# Altium project AMS_Master.PrjPcb
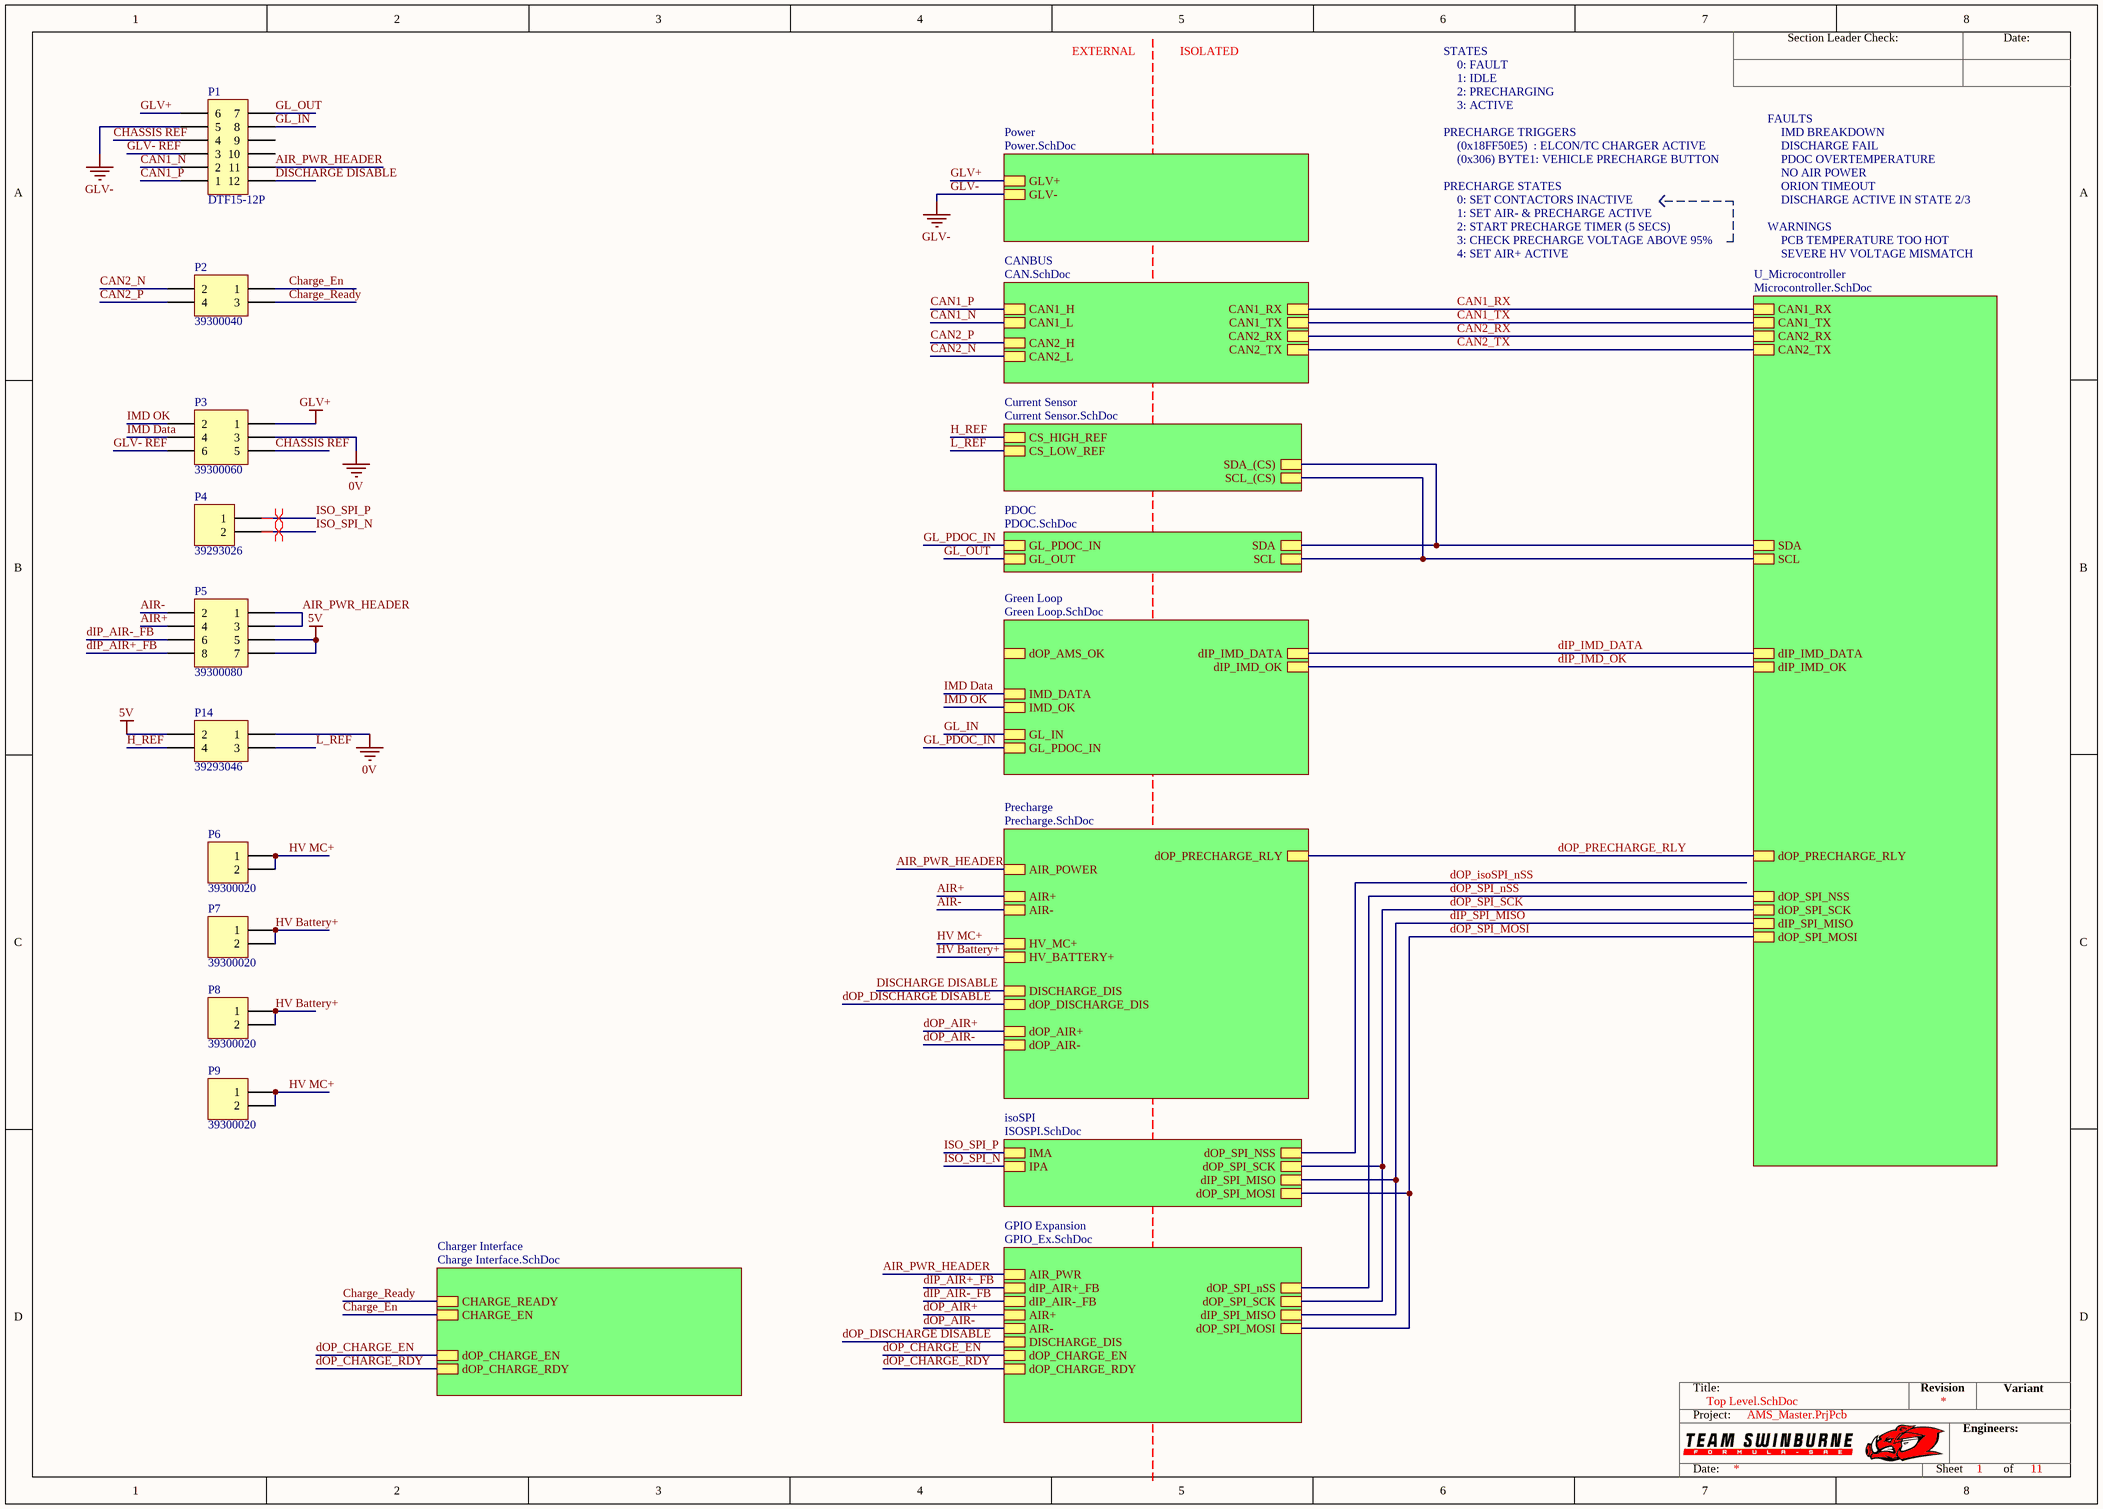
[diagram p0: Top Level.SchDoc]
10 sheets, 185 parts. Net scope: hierarchical (ports join the sheet entries above them; power ports are global).
Board file: AMS_Master_A1.PcbDoc
Sheets:
  Top Level.SchDoc
    U_Microcontroller = Microcontroller.SchDoc
    CANBUS = CAN.SchDoc
    Green Loop = Green Loop.SchDoc
    PDOC = PDOC.SchDoc
    Precharge = Precharge.SchDoc
    Charger Interface = Charge Interface.SchDoc
    Power = Power.SchDoc
    isoSPI = ISOSPI.SchDoc
    GPIO Expansion = GPIO_Ex.SchDoc

## Sheet Top Level.SchDoc
size A3; SheetNumber: 1; SheetTotal: 11

### Parts
P1  DTF15-12P  [DTF15-12P]
P2  39300040  [39300040]
P3  39300060  [39300060]
P4  39293026  [39293026]
P5  39300080  [39300080]
P6  39300020  [39300020]
P7  39300020  [39300020]
P8  39300020  [39300020]
P9  39300020  [39300020]
P14  39293046  [39293046]

### Sub-sheets
CANBUS = CAN.SchDoc: CAN1_RX, CAN1_TX, CAN2_RX, CAN2_TX, CAN1_H, CAN1_L, CAN2_H, CAN2_L
Charger Interface = Charge Interface.SchDoc: CHARGE_READY, CHARGE_EN, dOP_CHARGE_EN, dOP_CHARGE_RDY
Current Sensor = Current Sensor.SchDoc (file not in this document): SCL_(CS), CS_HIGH_REF, CS_LOW_REF, SDA_(CS)
GPIO Expansion = GPIO_Ex.SchDoc: dOP_SPI_nSS, dOP_SPI_SCK, dIP_SPI_MISO, dOP_SPI_MOSI, AIR_PWR, dIP_AIR+_FB, dIP_AIR-_FB, AIR+, AIR-, dOP_CHARGE_RDY, dOP_CHARGE_EN, DISCHARGE_DIS
Green Loop = Green Loop.SchDoc: dIP_IMD_DATA, dIP_IMD_OK, GL_IN, GL_PDOC_IN, IMD_DATA, IMD_OK, dOP_AMS_OK
isoSPI = ISOSPI.SchDoc: dOP_SPI_NSS, dOP_SPI_SCK, dIP_SPI_MISO, dOP_SPI_MOSI, IMA, IPA
PDOC = PDOC.SchDoc: SDA, SCL, GL_PDOC_IN, GL_OUT
Power = Power.SchDoc: GLV+, GLV-
Precharge = Precharge.SchDoc: dOP_AIR-, dOP_AIR+, dOP_PRECHARGE_RLY, DISCHARGE_DIS, AIR+, AIR-, HV_MC+, HV_BATTERY+, dOP_DISCHARGE_DIS, AIR_POWER
U_Microcontroller = Microcontroller.SchDoc: CAN1_RX, CAN1_TX, CAN2_RX, CAN2_TX, dOP_PRECHARGE_RLY, dOP_SPI_NSS, dOP_SPI_SCK, dIP_SPI_MISO, dOP_SPI_MOSI, dIP_IMD_DATA, dIP_IMD_OK, SDA, SCL

### Nets
0V: P3.3 P14.1
DISCHARGE DISABLE: P1.12 P5.5 P5.7 P14.2 ; sheet Precharge/DISCHARGE_DIS  [also labelled 5V]
GLV+: P1.6 P3.1 ; sheet Power/GLV+
GLV-: P1.5 ; sheet Power/GLV-
AIR+: P5.4 ; sheet Precharge/AIR+
AIR-: P5.2 ; sheet Precharge/AIR-
AIR_PWR_HEADER: P1.11 P5.1 P5.3 ; sheet Precharge/AIR_POWER, sheet GPIO Expansion/AIR_PWR
CAN1_N: P1.2 ; sheet CANBUS/CAN1_L
CAN1_P: P1.1 ; sheet CANBUS/CAN1_H
CAN1_RX: sheet U_Microcontroller/CAN1_RX, sheet CANBUS/CAN1_RX
CAN1_TX: sheet U_Microcontroller/CAN1_TX, sheet CANBUS/CAN1_TX
CAN2_N: P2.2 ; sheet CANBUS/CAN2_L
CAN2_P: P2.4 ; sheet CANBUS/CAN2_H
CAN2_RX: sheet U_Microcontroller/CAN2_RX, sheet CANBUS/CAN2_RX
CAN2_TX: sheet U_Microcontroller/CAN2_TX, sheet CANBUS/CAN2_TX
Charge_En: P2.1 ; sheet Charger Interface/CHARGE_EN
Charge_Ready: P2.3 ; sheet Charger Interface/CHARGE_READY
CHASSIS REF: P1.4 P3.5
dIP_AIR+_FB: P5.8 ; sheet GPIO Expansion/dIP_AIR+_FB
dIP_AIR-_FB: P5.6 ; sheet GPIO Expansion/dIP_AIR-_FB
dIP_IMD_DATA: sheet U_Microcontroller/dIP_IMD_DATA, sheet Green Loop/dIP_IMD_DATA
dIP_IMD_OK: sheet U_Microcontroller/dIP_IMD_OK, sheet Green Loop/dIP_IMD_OK
dIP_SPI_MISO: sheet U_Microcontroller/dIP_SPI_MISO, sheet isoSPI/dIP_SPI_MISO, sheet GPIO Expansion/dIP_SPI_MISO
dOP_AIR+: sheet Precharge/dOP_AIR+, sheet GPIO Expansion/AIR+
dOP_AIR-: sheet Precharge/dOP_AIR-, sheet GPIO Expansion/AIR-
dOP_CHARGE_EN: sheet Charger Interface/dOP_CHARGE_EN, sheet GPIO Expansion/dOP_CHARGE_EN
dOP_CHARGE_RDY: sheet Charger Interface/dOP_CHARGE_RDY, sheet GPIO Expansion/dOP_CHARGE_RDY
dOP_DISCHARGE DISABLE: sheet Precharge/dOP_DISCHARGE_DIS, sheet GPIO Expansion/DISCHARGE_DIS
dOP_PRECHARGE_RLY: sheet U_Microcontroller/dOP_PRECHARGE_RLY, sheet Precharge/dOP_PRECHARGE_RLY
dOP_SPI_MOSI: sheet U_Microcontroller/dOP_SPI_MOSI, sheet isoSPI/dOP_SPI_MOSI, sheet GPIO Expansion/dOP_SPI_MOSI
dOP_SPI_nSS: sheet U_Microcontroller/dOP_SPI_NSS, sheet GPIO Expansion/dOP_SPI_nSS
dOP_SPI_SCK: sheet U_Microcontroller/dOP_SPI_SCK, sheet isoSPI/dOP_SPI_SCK, sheet GPIO Expansion/dOP_SPI_SCK
GL_IN: P1.8 ; sheet Green Loop/GL_IN
GL_OUT: P1.7 ; sheet PDOC/GL_OUT
GL_PDOC_IN: sheet Green Loop/GL_PDOC_IN, sheet PDOC/GL_PDOC_IN
GLV- REF: P1.3 P3.6
H_REF: P14.4 ; sheet Current Sensor/CS_HIGH_REF
HV Battery+: P7.1 P7.2 P8.1 P8.2 ; sheet Precharge/HV_BATTERY+
HV MC+: P6.1 P6.2 P9.1 P9.2 ; sheet Precharge/HV_MC+
I2C1_SCL: sheet U_Microcontroller/SCL, sheet PDOC/SCL, sheet Current Sensor/SCL_(CS)
I2C1_SDA: sheet U_Microcontroller/SDA, sheet PDOC/SDA, sheet Current Sensor/SDA_(CS)
IMD Data: P3.4 ; sheet Green Loop/IMD_DATA
IMD OK: P3.2 ; sheet Green Loop/IMD_OK
ISO_SPI_N: P4.2 ; sheet isoSPI/IPA
ISO_SPI_P: P4.1 ; sheet isoSPI/IMA
L_REF: P14.3 ; sheet Current Sensor/CS_LOW_REF

Not connected (* = marked no-connect by the designer): P1 9 10

### Layout directives
differential pair: ISO_SPI_N, ISO_SPI_P

### Notes on the sheet
- EXTERNAL
- ISOLATED
- STATES
- 0: FAULT
- 1: IDLE
- 2: PRECHARGING
- 3: ACTIVE
- PRECHARGE TRIGGERS
- (0x18FF50E5)  : ELCON/TC CHARGER ACTIVE
- (0x306) BYTE1: VEHICLE PRECHARGE BUTTON
- FAULTS
- IMD BREAKDOWN
- DISCHARGE FAIL
- PDOC OVERTEMPERATURE
- NO AIR POWER
- PRECHARGE STATES
- 1: SET AIR- & PRECHARGE ACTIVE
- 2: START PRECHARGE TIMER (5 SECS)
- 3: CHECK PRECHARGE VOLTAGE ABOVE 95%
- 0: SET CONTACTORS INACTIVE
- WARNINGS
- PCB TEMPERATURE TOO HOT
- ORION TIMEOUT
- DISCHARGE ACTIVE IN STATE 2/3
- 4: SET AIR+ ACTIVE
- SEVERE HV VOLTAGE MISMATCH
- Section Leader Check:
- Date:
- Title:
- Revision
- Variant
- Project:
- Engineers:
- Sheet
- of

### Library data of the parts
P1 = DTF15-12P: Positions: 12; Pitch: 4.44mm; Row Spacing: 9.12 mm; Angle: 0; Flange: No; Contact: Copper Alloy; Part Number: DTF15-12P; Digikey Part Number: 1734-1647-ND; Digikey Link: https://www.digikey.com.au/product-detail/en/te-connectivity-deutsch-connectors/DTF15-12PA/1734-1647-ND/7220164
P2 = 39300040: Pitch: 4.2mm; Row Spacing: 5.5mm; Angle: 90; Flange: No; Contact: Tin; Part Number: 39300040; Positions: 4; Digikey Part Number: WM21352-ND
P3 = 39300060: Pitch: 4.2mm; Row Spacing: 5.5mm; Angle: 90; Flange: No; Contact: Tin; Part Number: 39300060; Positions: 6; Digikey Part Number: WM21353-ND
P4 = 39293026: Pitch: 4.2mm; Row Spacing: 5.5mm; Angle: 0; Flange: No; Contact: Tin; Part Number: 39293026; Positions: 2; Digikey Part Number: WM3843-ND
P5 = 39300080: Pitch: 4.2mm; Row Spacing: 5.5mm; Angle: 90; Flange: No; Contact: Tin; Part Number: 39300080; Positions: 8; Digikey Part Number: WM21354-ND
P6-P9 = 39300020: Pitch: 4.2mm; Row Spacing: 5.5mm; Angle: 90; Flange: No; Contact: Tin; Part Number: 39300020; Positions: 2; Digikey Part Number: WM21351-ND
P14 = 39293046: Pitch: 4.2mm; Row Spacing: 5.5mm; Angle: 0; Flange: No; Contact: Tin; Part Number: 39293046; Positions: 4; Digikey Part Number: WM3844-ND

## Sheet Microcontroller.SchDoc
size A4; SheetNumber: 7; SheetTotal: 11
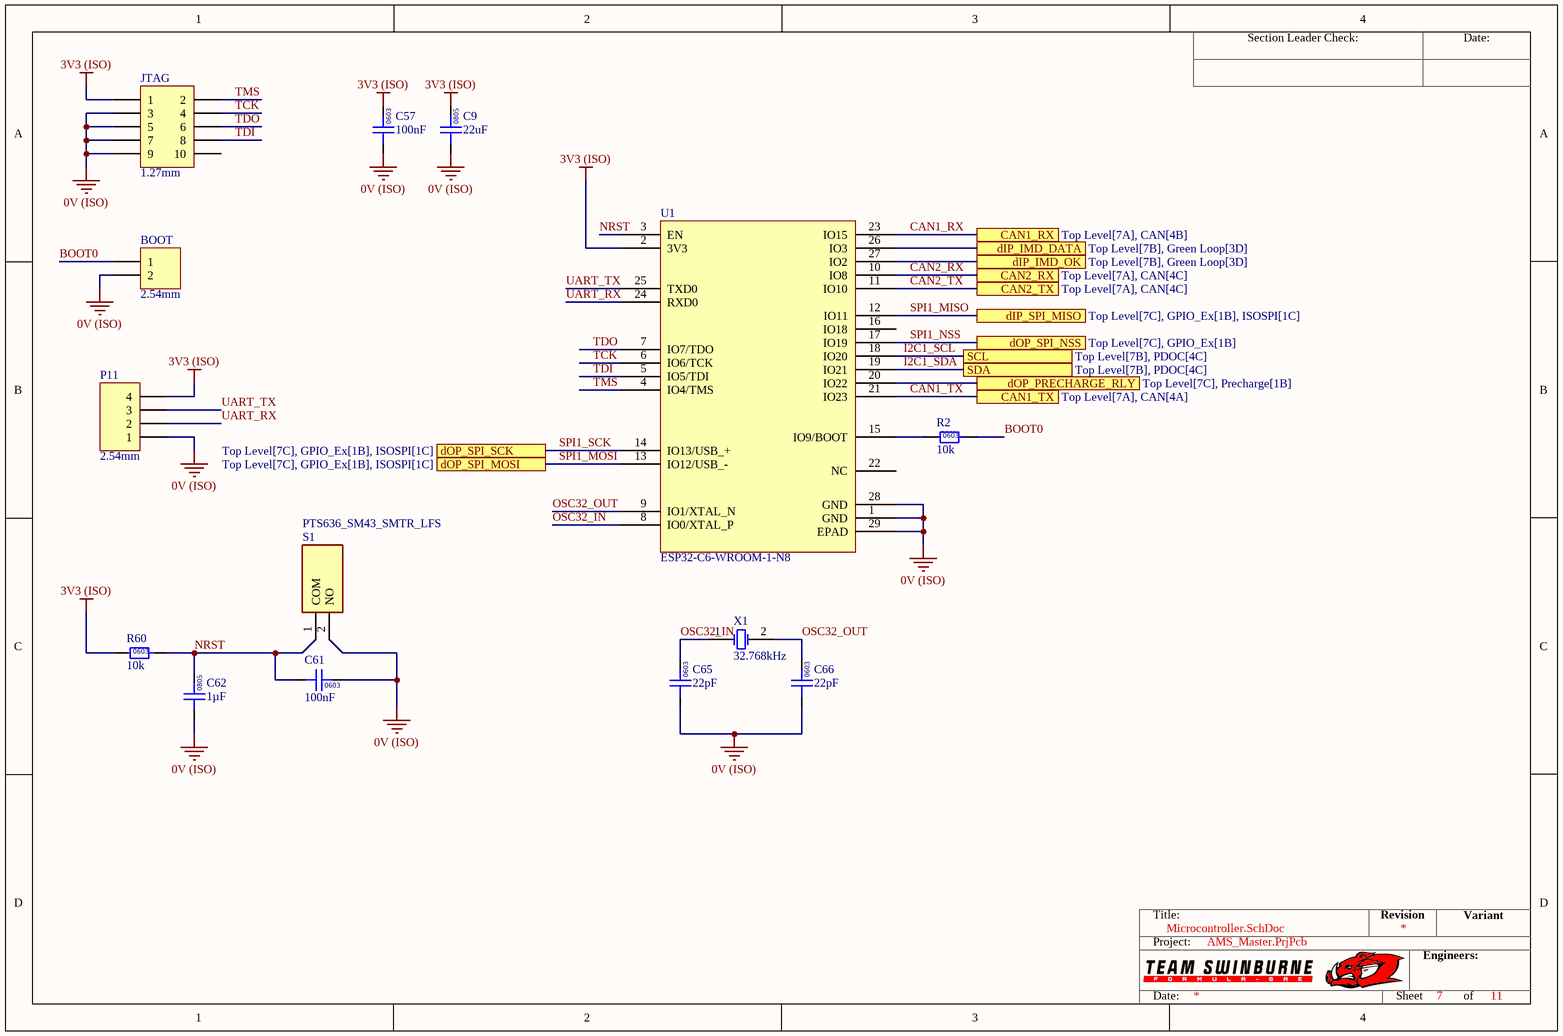
[diagram p1: Microcontroller.SchDoc]

### Parts
BOOT  2.54mm  [TH 2.54mm Header 1x2]
C9  22uF  [0805]
C57  100nF  [0603]
C61  100nF  [0603]
C62  1µF  [0805]
C65  22pF  [0603]
C66  22pF  [0603]
JTAG  1.27mm  [3221-10-0300-00]
P11  2.54mm  [TH 2.54mm Header 1x4]
R2  10k  [0603]
R60  10k  [0603]
S1  PTS636_SM43_SMTR_LFS  [PTS636SM43SMTRLFS]
U1  ESP32-C6-WROOM-1-N8  [ESP32-C6-WROOM-1-N8]
X1  32.768kHz  [EPSON 2-SMD]

### Ports
CAN1_RX (see Top Level[7A], CAN[4B]), CAN1_TX (see Top Level[7A], CAN[4A]), CAN2_RX (see Top Level[7A], CAN[4C]), CAN2_TX (see Top Level[7A], CAN[4C]), dIP_IMD_DATA (see Top Level[7B], Green Loop[3D]), dIP_IMD_OK (see Top Level[7B], Green Loop[3D]), dIP_SPI_MISO (see Top Level[7C], GPIO_Ex[1B], ISOSPI[1C]), dOP_PRECHARGE_RLY (see Top Level[7C], Precharge[1B]), dOP_SPI_MOSI (see Top Level[7C], GPIO_Ex[1B], ISOSPI[1C]), dOP_SPI_NSS (see Top Level[7C], GPIO_Ex[1B]), dOP_SPI_SCK (see Top Level[7C], GPIO_Ex[1B], ISOSPI[1C]), SCL (see Top Level[7B], PDOC[4C]), SDA (see Top Level[7B], PDOC[4C])

### Nets
0V (ISO): BOOT.2 C9.1 C57.1 C61.2 C62.1 C65.1 C66.1 JTAG.3 JTAG.5 JTAG.7 JTAG.9 P11.1 S1.2(NO) U1.1(GND) U1.28(GND) U1.29(EPAD)
3V3 (ISO): C9.2 C57.2 JTAG.1 P11.4 R60.1 U1.2(3V3)
BOOT0: BOOT.1 R2.2
CAN1_RX: U1.23(IO15) ; port CAN1_RX
CAN1_TX: U1.21(IO23) ; port CAN1_TX
CAN2_RX: U1.10(IO8) ; port CAN2_RX
CAN2_TX: U1.11(IO10) ; port CAN2_TX
dIP_IMD_DATA: U1.26(IO3) ; port dIP_IMD_DATA
dIP_IMD_OK: U1.27(IO2) ; port dIP_IMD_OK
dOP_PRECHARGE_RLY: U1.20(IO22) ; port dOP_PRECHARGE_RLY
I2C1_SCL: U1.18(IO20) ; port SCL
I2C1_SDA: U1.19(IO21) ; port SDA
NRST: C61.1 C62.2 R60.2 S1.1(COM) U1.3(EN)
OSC32_IN: C65.2 U1.8(IO0/XTAL_P) X1.1(OSC1)
OSC32_OUT: C66.2 U1.9(IO1/XTAL_N) X1.2(OSC2)
SPI1_MISO: U1.12(IO11) ; port dIP_SPI_MISO  [project net dIP_SPI_MISO]
SPI1_MOSI: U1.13(IO12/USB_-) ; port dOP_SPI_MOSI  [project net dOP_SPI_MOSI]
SPI1_NSS: U1.17(IO19) ; port dOP_SPI_NSS  [project net dOP_SPI_nSS]
SPI1_SCK: U1.14(IO13/USB_+) ; port dOP_SPI_SCK  [project net dOP_SPI_SCK]
TCK: JTAG.4 U1.6(IO6/TCK)
TDI: JTAG.8 U1.5(IO5/TDI)
TDO: JTAG.6 U1.7(IO7/TDO)
TMS: JTAG.2 U1.4(IO4/TMS)
UART_RX: P11.2 U1.24(RXD0)
UART_TX: P11.3 U1.25(TXD0)
NetR2_1: R2.1 U1.15(IO9/BOOT)

Not connected (* = marked no-connect by the designer): JTAG 10; U1 16(IO18) 22(NC)

### Notes on the sheet
- Section Leader Check:
- Date:
- Title:
- Revision
- Variant
- Project:
- Engineers:
- Sheet
- of
- (in symbol GCM21BR71H105KA03L) 0805
- (in symbol GCM188L81H104KA57D) 0603
- (in symbol GRM21BR61A226ME51L) 0805
- (in symbol GRM0335C1H220JA01D) 0603
- (in symbol RC0603FR-0710KL) 0603

### Library data of the parts
BOOT = TH 2.54mm Header 1x2: Positions: 2; Angle: 0; Flange: No; Contact: NA; Part Number: TH 2.54mm Header 1x2; Pitch: 2.54mm; Row Spacing: 2.54mm
C9 = GRM21BR61A226ME51L: Manufacturer: muRata; Rated Voltage: 50V; Tolerance: 20%; Material: MLCC; Temperature Rating: X5R; Part Number: GRM21BR61A226ME51L; Value: 22uF; Digikey Part Number: 490-10511-1-ND
C57 C61 = GCM188L81H104KA57D: Manufacturer: muRata; Rated Voltage: 50V; Tolerance: ±10%; Material: MLCC; Temperature Rating: X8L; Part Number: GCM188L81H104KA57D; Value: 100nF; Digikey Part Number: 490-6049-1-ND
C62 = GCM21BR71H105KA03L: Manufacturer: muRata; Rated Voltage: 50V; Tolerance: ±10%; Material: MLCC; Temperature Rating: X7R; Part Number: GCM21BR71H105KA03L; Value: 1µF; Digikey Part Number: 490-10675-1-ND
C65 C66 = GRM0335C1H220JA01D: Manufacturer: Murata Electronics; Rated Voltage: 50V; Tolerance: ±5%; Material: MLCC; Temperature Rating: C0G, NP0; Part Number: GRM0335C1H220JA01D; Value: 22pF; Digikey Part Number: 490-6123-1-ND
JTAG = SMD 1.27mm Header 2x5 (3221-10-0300-00): Positions: 10; Angle: 0; Flange: No; Contact: NA; Part Number: SMD 1.27mm Header 2x5 (3221-10-0300-00); Pitch: 1.27mm; Row Spacing: 1.27mm
P11 = TH 2.54mm Header 1x4: Positions: 4; Angle: 0; Flange: No; Contact: NA; Part Number: TH 2.54mm Header 1x4; Pitch: 2.54mm; Row Spacing: 2.54mm
R2 R60 = RC0603FR-0710KL: Manufacturer: YAGEO; Tolerance: 0.01; Rated Power: 0.1W; Part Number: RC0603FR-0710KL; Value: 10k; Material: FR-07; Digikey Part Number: 311-10.0KHRCT-ND
S1 = PTS636_SM43_SMTR_LFS: Switch; Manufacturer_Name: C & K COMPONENTS; Manufacturer_Part_Number: PTS636 SM43 SMTR LFS; Datasheet Link: https://componentsearchengine.com/Datasheets/1/PTS636 SM43 SMTR LFS.pdf; Height: 4.5mm; Mouser Part Number: 611-PTS636SM43SMTRLF; Mouser Price/Stock: https://www.mouser.co.uk/ProductDetail/CK/PTS636-SM43-SMTR-LFS?qs=vLWxofP3U2xu5raMGkTmHg%3D%3D; Arrow Part Number: PTS636 SM43 SMTR LFS; Arrow Price/Stock: https://www.arrow.com/en/products/pts636-sm43-smtr-lfs/ck
U1 = ESP32-C6-WROOM-1-N8: RF TXRX MOD BT WIFI PCB TH SMD; Manufacturer: Espressif; Complex IC: 1; Part Number: ESP32-C6-WROOM-1-N8
X1 = FC-135 32.7680KA-A5: Manufacturer: EPSON; Load Capacitance: 12.5pF; ESR: 70k; Part Number: FC-135 32.7680KA-A5; Value: 32.768kHz; Digikey Part Number: SER4103TR-ND; Digikey Link: https://www.digikey.com/product-detail/en/epson/FC-135-32.7680KA-A5/SER4103TR-ND/5259895

## Sheet CAN.SchDoc
size A4; SheetNumber: 2; SheetTotal: 11
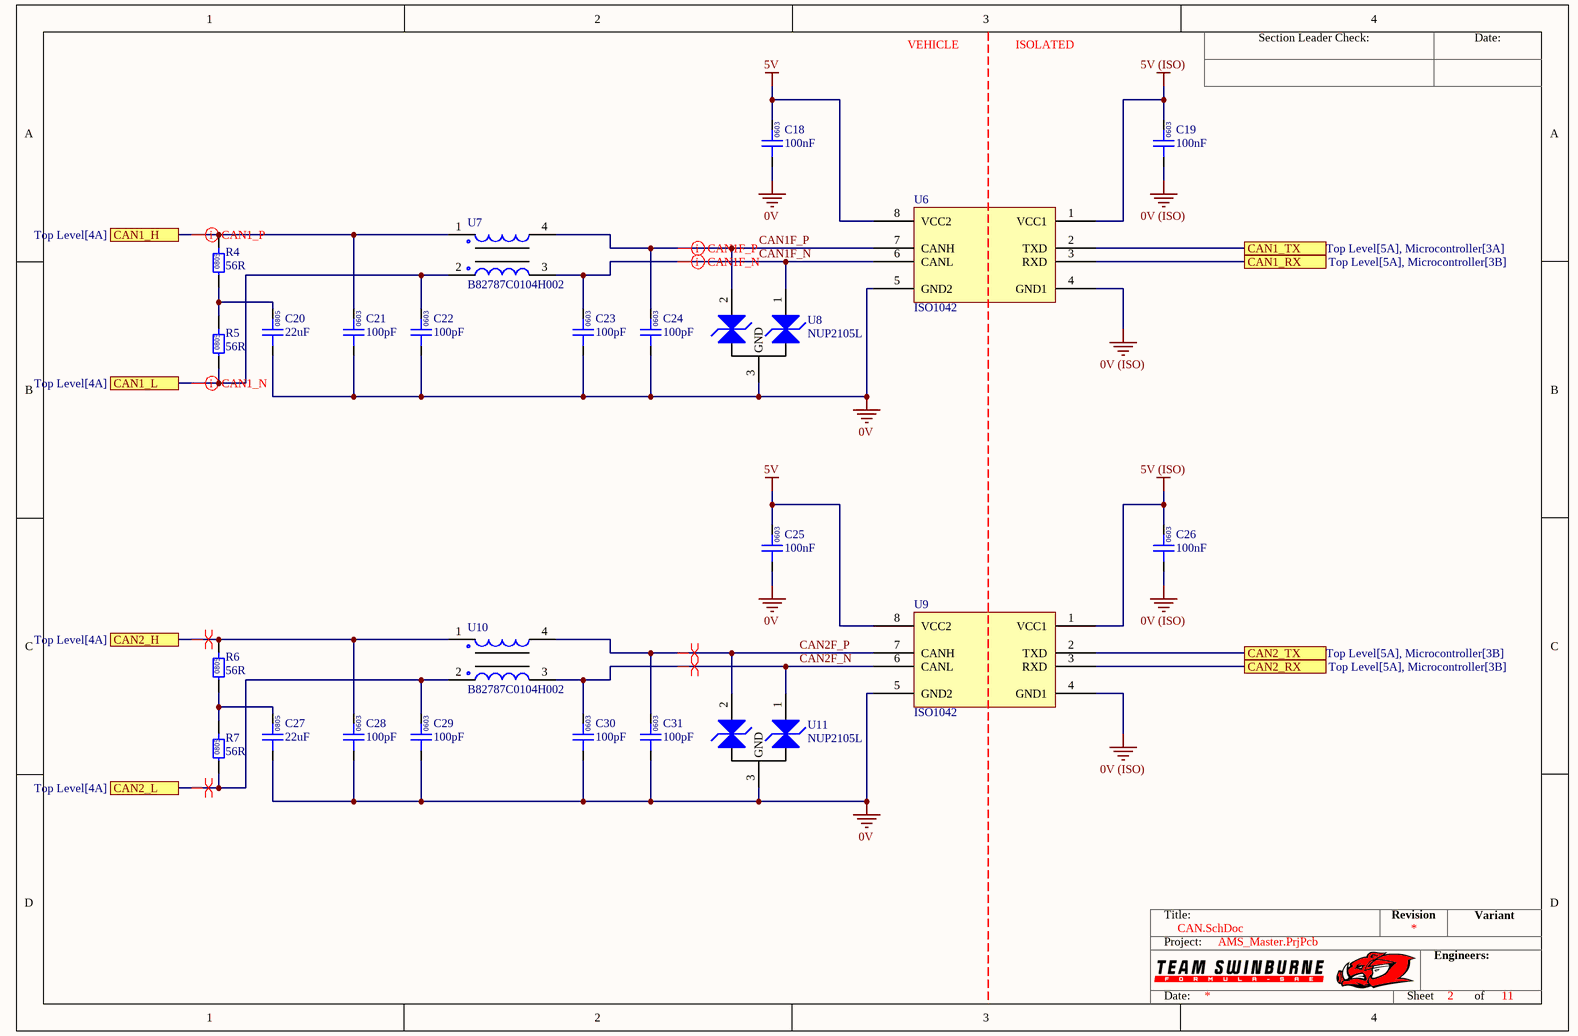
[diagram p2: CAN.SchDoc]

### Parts
C18  100nF  [0603]
C19  100nF  [0603]
C20  22uF  [0805]
C21  100pF  [0603]
C22  100pF  [0603]
C23  100pF  [0603]
C24  100pF  [0603]
C25  100nF  [0603]
C26  100nF  [0603]
C27  22uF  [0805]
C28  100pF  [0603]
C29  100pF  [0603]
C30  100pF  [0603]
C31  100pF  [0603]
R4  56R  [0805]
R5  56R  [0805]
R6  56R  [0805]
R7  56R  [0805]
U6  ISO1042  [TI-SOIC-8]
U7  B82787C0104H002  [TDK 4-PC Pad]
U8  NUP2105L  [ON SOT-23]
U9  ISO1042  [TI-SOIC-8]
U10  B82787C0104H002  [TDK 4-PC Pad]
U11  NUP2105L  [ON SOT-23]

### Ports
CAN1_H (see Top Level[4A]), CAN1_L (see Top Level[4A]), CAN1_RX (see Top Level[5A], Microcontroller[3B]), CAN1_TX (see Top Level[5A], Microcontroller[3A]), CAN2_H (see Top Level[4A]), CAN2_L (see Top Level[4A]), CAN2_RX (see Top Level[5A], Microcontroller[3B]), CAN2_TX (see Top Level[5A], Microcontroller[3B])

### Nets
0V: C18.1 C20.1 C21.1 C22.1 C23.1 C24.1 C25.1 C27.1 C28.1 C29.1 C30.1 C31.1 U6.5(GND2) U8.3(GND) U9.5(GND2) U11.3(GND)
0V (ISO): C19.1 C26.1 U6.4(GND1) U9.4(GND1)
5V: C18.2 C25.2 U6.8(VCC2) U9.8(VCC2)  [project net DISCHARGE DISABLE]
5V (ISO): C19.2 C26.2 U6.1(VCC1) U9.1(VCC1)
CAN1_N: C22.2 R5.1 U7.2 ; port CAN1_L
CAN1_P: C21.2 R4.2 U7.1 ; port CAN1_H
CAN1_RX: U6.3(RXD) ; port CAN1_RX
CAN1_TX: U6.2(TXD) ; port CAN1_TX
CAN1F_N: C23.2 U6.6(CANL) U7.3 U8.1(CAN_H)
CAN1F_P: C24.2 U6.7(CANH) U7.4 U8.2(CAN_L)
CAN2_N: C29.2 R7.1 U10.2 ; port CAN2_L
CAN2_P: C28.2 R6.2 U10.1 ; port CAN2_H
CAN2_RX: U9.3(RXD) ; port CAN2_RX
CAN2_TX: U9.2(TXD) ; port CAN2_TX
CAN2F_N: C30.2 U9.6(CANL) U10.3 U11.1(CAN_H)
CAN2F_P: C31.2 U9.7(CANH) U10.4 U11.2(CAN_L)
NetC20_2: C20.2 R4.1 R5.2
NetC27_2: C27.2 R6.1 R7.2

### Layout directives
differential pair: CAN1_N, CAN1_P, CAN1F_N, CAN1F_P, CAN2_N, CAN2_P, CAN2F_N, CAN2F_P

### Notes on the sheet
- VEHICLE
- ISOLATED
- Section Leader Check:
- Date:
- Title:
- Revision
- Variant
- Project:
- Engineers:
- Sheet
- of
- (in symbol GCM188L81H104KA57D) 0603
- (in symbol GRM21BR61A226ME51L) 0805
- (in symbol GRM1885C1H101JA01D) 0603
- (in symbol RC0805FR0756RL) 0805

### Library data of the parts
C18 C19 C25 C26 = GCM188L81H104KA57D: as C57 on sheet Microcontroller; Part Number: GCM188L81H104KA57D; Value: 100nF; Digikey Part Number: 490-6049-1-ND
C20 C27 = GRM21BR61A226ME51L: Manufacturer: muRata; Rated Voltage: 10V; Tolerance: 20%; Material: MLCC; Temperature Rating: X5R; Part Number: GRM21BR61A226ME51L; Value: 22uF; Digikey Part Number: 490-10511-1-ND
C21-C24 C28-C31 = GRM1885C1H101JA01D: Manufacturer: Murata Electronics; Rated Voltage: 50V; Tolerance: ±5%; Material: MLCC; Temperature Rating: C0G, NP0; Part Number: GRM1885C1H101JA01D; Value: 100pF; Digikey Part Number: 490-1427-1-ND
R4-R7 = RC0805FR0756RL: Manufacturer: YAGEO; Tolerance: 0.01; Rated Power: 0.125W; Part Number: RC0805FR0756RL; Value: 56R; Material: FR-07; Digikey Part Number: 311-56.0CRCT-ND
U6 U9 = ISO1042: IC CAN TRANSCEIVER 1/1 8SOIC; Manufacturer: Texas Instruments; Part Number: ISO1042; Digikey Part Number: 296-ISO1042BQDWVQ1-ND
U7 U10 = B82787C0104H002: Manufacturer: EPCOS (TDK); Value: 100µH @ 100kHz; Impedance: 5.8 kOhms @ 10MHz; Rated Current: 150mA; Part Number: B82787C0104H002; Material: Wirewound; Digikey Part Number: 495-4598-1-ND
U8 U11 = NUP2105L: Dual Line CAN Bus Protector; Manufacturer: ON Semiconductor; Part Number: NUP2105L; Digikey Part Number: NUP2105LT1GOSCT-ND; Digikey Link: https://www.digikey.com/product-detail/en/on-semiconductor/NUP2105LT1G/NUP2105LT1GOSCT-ND/1485001

## Sheet Green Loop.SchDoc
size A3; SheetNumber: 5; SheetTotal: 11
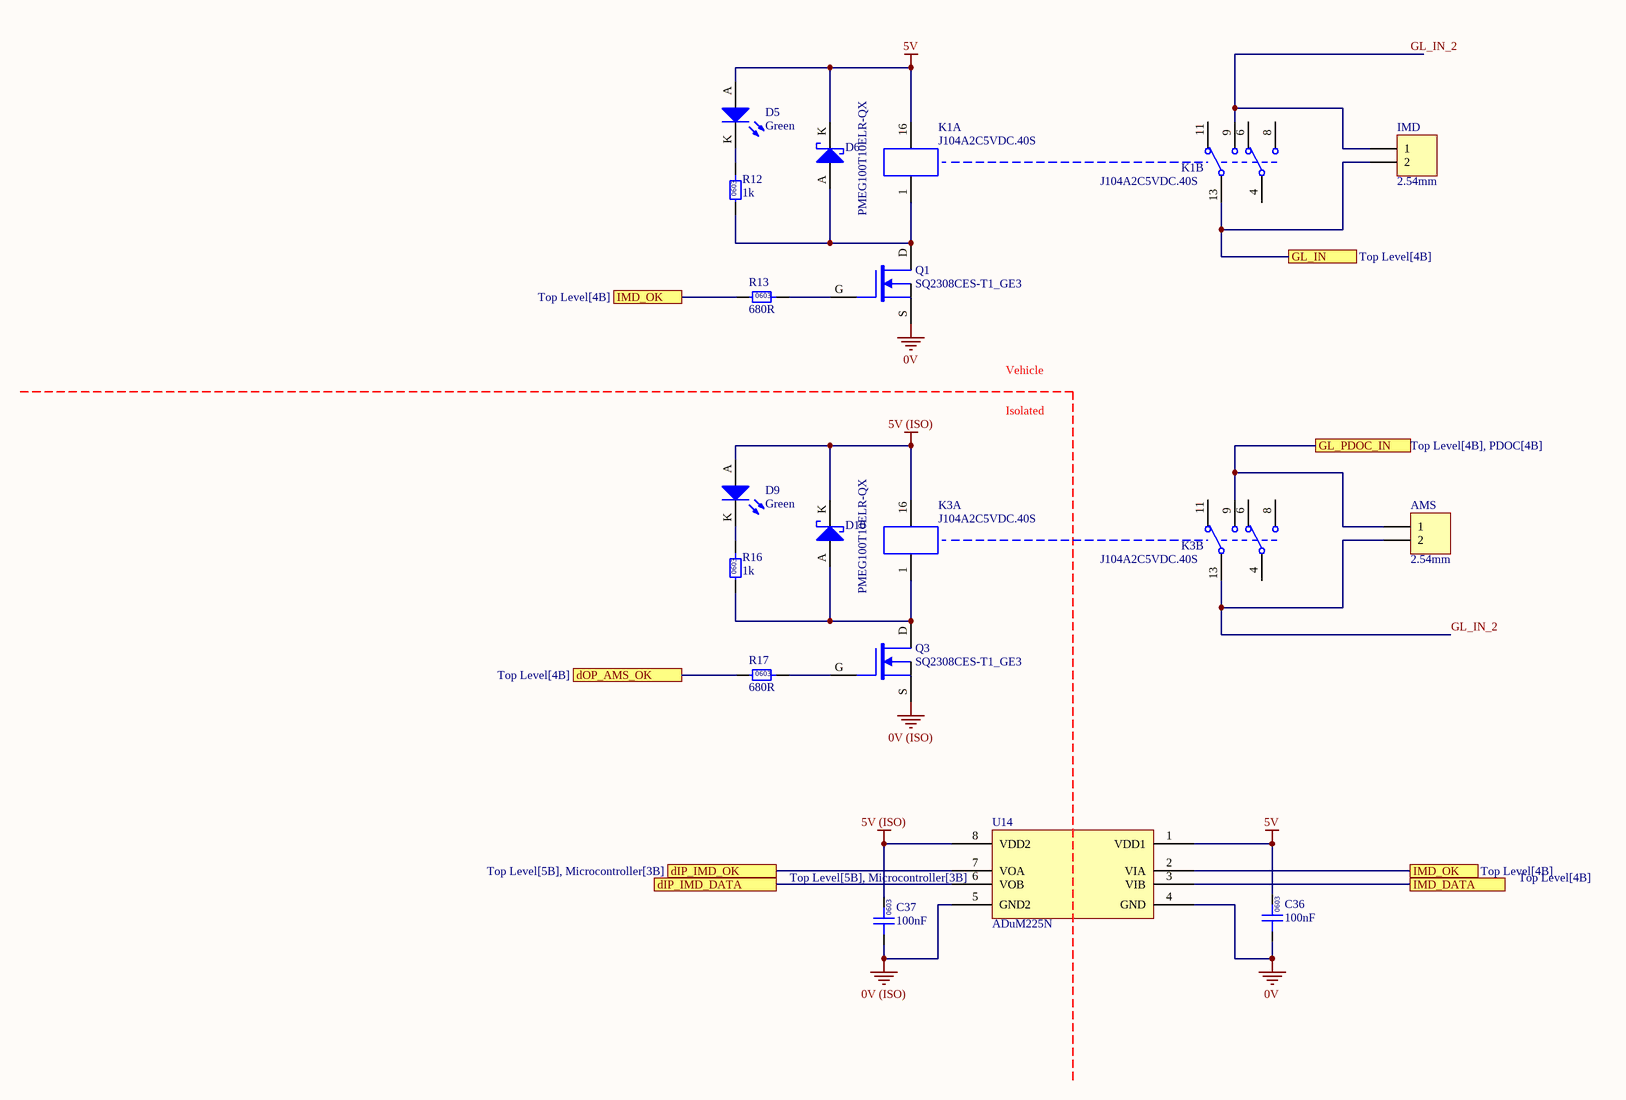
[diagram p3: Green Loop.SchDoc]

### Parts
AMS  2.54mm  [TH 2.54mm Header 1x2]
C36  100nF  [0603]
C37  100nF  [0603]
D5  Green  [0805 LED]
D6  PMEG100T10ELR-QX  [NXP SOD123W]
D9  Green  [0805 LED]
D10  PMEG100T10ELR-QX  [NXP SOD123W]
IMD  2.54mm  [TH 2.54mm Header 1x2]
K1  J104A2C5VDC.40S  [TI 2-DIL]  (parts A,B of 2)
K3  J104A2C5VDC.40S  [TI 2-DIL]  (parts A,B of 2)
Q1  SQ2308CES-T1_GE3  [VSHY SOT-23-3]
Q3  SQ2308CES-T1_GE3  [VSHY SOT-23-3]
R12  1k  [0603]
R13  680R  [0603]
R16  1k  [0603]
R17  680R  [0603]
U14  ADuM225N  [AD-SOIC-8W]

### Ports
dIP_IMD_DATA (see Top Level[5B], Microcontroller[3B]), dIP_IMD_OK (see Top Level[5B], Microcontroller[3B]), dOP_AMS_OK (see Top Level[4B]), GL_IN (see Top Level[4B]), GL_PDOC_IN (see Top Level[4B], PDOC[4B]), IMD_DATA (see Top Level[4B]), IMD_OK (see Top Level[4B])

### Nets
0V: C36.1 Q1.S U14.4(GND)
0V (ISO): C37.1 Q3.S U14.5(GND2)
5V: C36.2 D5.A D6.K K1.16 U14.1(VDD1)  [project net DISCHARGE DISABLE]
5V (ISO): C37.2 D9.A D10.K K3.16 U14.8(VDD2)
dIP_IMD_DATA: U14.6(VOB) ; port dIP_IMD_DATA
dIP_IMD_OK: U14.7(VOA) ; port dIP_IMD_OK
GL_IN: IMD.2 K1.13 ; port GL_IN
GL_IN_2: AMS.2 IMD.1 K1.9 K3.13
GL_PDOC_IN: AMS.1 K3.9 ; port GL_PDOC_IN
IMD Data: U14.3(VIB) ; port IMD_DATA
IMD OK: R13.1 U14.2(VIA) ; port IMD_OK
NetD5_K: D5.K R12.2
NetD6_A: D6.A K1.1 Q1.D R12.1
NetD9_K: D9.K R16.2
NetD10_A: D10.A K3.1 Q3.D R16.1
NetQ1_G: Q1.G R13.2
NetQ3_G: Q3.G R17.2
NetR17_1: R17.1 ; port dOP_AMS_OK

Not connected (* = marked no-connect by the designer): K1 4 6 8 11; K3 4 6 8 11

### Notes on the sheet
- Vehicle
- Isolated
- Section Leader Check:
- Date:
- Title:
- Revision
- Variant
- Project:
- Engineers:
- Sheet
- of
- (in symbol GCM188L81H104KA57D) 0603
- (in symbol RC0603FR-071KL) 0603
- (in symbol RC0603JR-13680RL) 0603

### Library data of the parts
AMS IMD = TH 2.54mm Header 1x2: as BOOT on sheet Microcontroller; Part Number: TH 2.54mm Header 1x2; Pitch: 2.54mm; Row Spacing: 2.54mm
C36 C37 = GCM188L81H104KA57D: as C57 on sheet Microcontroller; Part Number: GCM188L81H104KA57D; Value: 100nF; Digikey Part Number: 490-6049-1-ND
D5 D9 = SML-210FTT86: Green LED Indication - Discrete 1.75V 0805 (2012 Metric); Manufacturer: ROHM Semiconductor; Part Number: SML-210FTT86; Colour: Green; Digikey Part Number: 511-1285-1-ND; Digikey Link: https://www.digikey.com/product-detail/en/rohm-semiconductor/SML-210FTT86/511-1285-1-ND/637098
D6 D10 = PMEG100T10ELR-QX: Manufacturer: Nexperia USA Inc.; Forward Voltage: 0.75 V @ 1A; Breakdown Voltage: 100 V; Rated Power: 680 mW; Part Number: PMEG100T10ELR-QX; Digikey Part Number: 1727-PMEG100T10ELR-QXCT-ND
K1 K3 = J104A2C5VDC.40S: RELAY GEN PURPOSE DPDT 3A 5V; Manufacturer: CIT Relay and Switch; Part Number: J104A2C5VDC.40S; Digikey Part Number: 2449-J104A2C5VDC.40S-ND; Digikey Link: https://www.digikey.com.au/en/products/detail/cit-relay-and-switch/J104A2C5VDC-40S/14002119
Q1 Q3 = SQ2308CES-T1_GE3: MOSFET N-CH 60V 2.3A SOT23; Manufacturer: Vishay Siliconix; Type: N-channel; Rated Power: 2W; Published: 24-Mar-1999; LatestRevisionDate: 29-May-2009; LatestRevisionNote: IPC-7351 Footprint Added.; PackageVersion: Sep-2000; PackageReference: SOT-343; Publisher: Altium Limited; PackageDescription: 4-Pin SOT-343 Package 1.3 mm Pitch, 2.1 mm Lead Span; Part Number: SQ2308CES-T1_GE3; Digikey Part Number: SQ2308CES-T1_GE3CT-ND
R12 R16 = RC0603FR-071KL: Manufacturer: YAGEO; Tolerance: 0.01; Rated Power: 0.1W; Part Number: RC0603FR-071KL; Value: 1k; Material: FR-07; Digikey Part Number: 311-1.00KHRCT-ND
R13 R17 = RC0603JR-13680RL: Manufacturer: YAGEO; Tolerance: 0.01; Rated Power: 0.1W; Part Number: RC0603JR-13680RL; Value: 680R; Material: FR-07; Digikey Part Number: 13-RC0603JR-13680RLCT-ND
U14 = ADuM225N: DIGITAL ISOLATOR, DUAL CHANNEL; Manufacturer: Analogue Devices; Part Number: ADuM225N

## Sheet PDOC.SchDoc
size A4; SheetNumber: 8; SheetTotal: 11
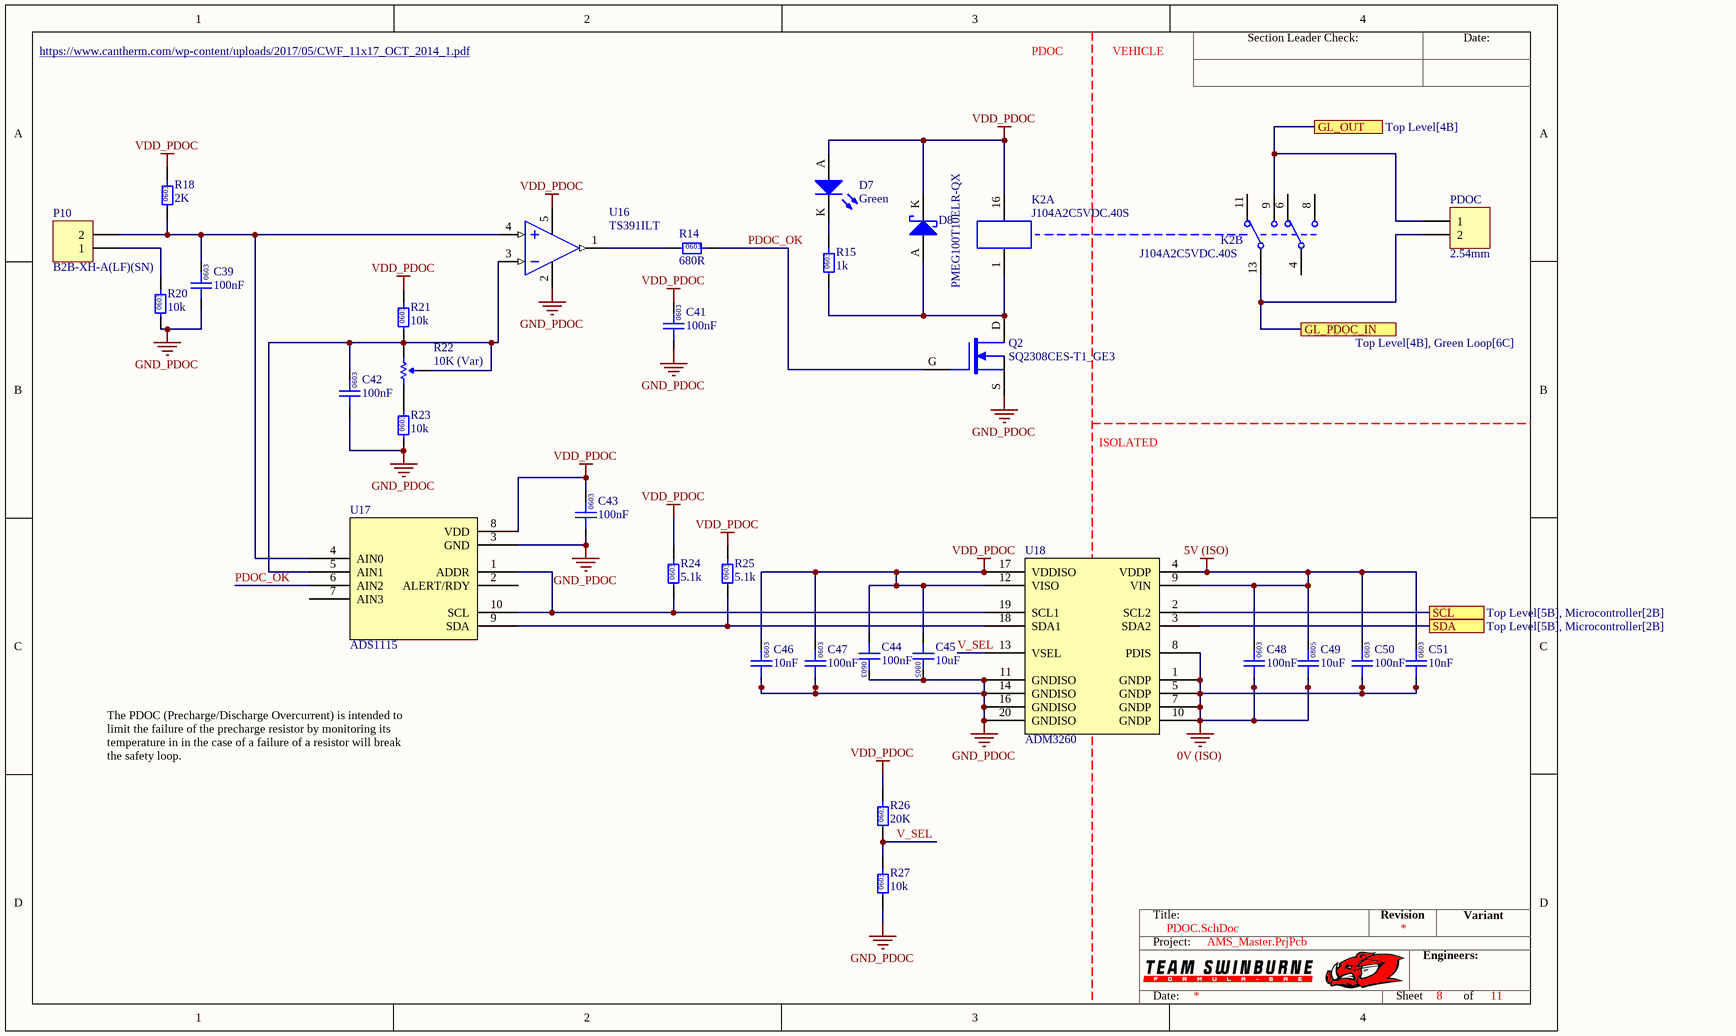
[diagram p4: PDOC.SchDoc]

### Parts
C39  100nF  [0603]
C41  100nF  [0603]
C42  100nF  [0603]
C43  100nF  [0603]
C44  100nF  [0603]
C45  10uF  [0805]
C46  10nF  [0603]
C47  100nF  [0603]
C48  100nF  [0603]
C49  10uF  [0805]
C50  100nF  [0603]
C51  10nF  [0603]
D7  Green  [0805 LED]
D8  PMEG100T10ELR-QX  [NXP SOD123W]
K2  J104A2C5VDC.40S  [TI 2-DIL]  (parts A,B of 2)
P10  B2B-XH-A(LF)(SN)  [XH 2 PIN VERT]
PDOC  2.54mm  [TH 2.54mm Header 1x2]
Q2  SQ2308CES-T1_GE3  [VSHY SOT-23-3]
R14  680R  [0603]
R15  1k  [0603]
R18  2K  [0603]
R20  10k  [0603]
R21  10k  [0603]
R22  10K (Var)  [B 3296]
R23  10k  [0603]
R24  5.1k  [0603]
R25  5.1k  [0603]
R26  20K  [0603]
R27  10k  [0603]
U16  TS391ILT  [ON SOT-23-5]
U17  ADS1115  [TI 10-VSSOP]
U18  ADM3260  [AD 20-SSOP]

### Ports
GL_OUT (see Top Level[4B]), GL_PDOC_IN (see Top Level[4B], Green Loop[6C]), SCL (see Top Level[5B], Microcontroller[2B]), SDA (see Top Level[5B], Microcontroller[2B])

### Nets
0V (ISO): C48.1 C49.1 C50.1 C51.1 U18.1(GNDP) U18.5(GNDP) U18.7(GNDP) U18.8(PDIS) U18.10(GNDP)
5V (ISO): C48.2 C49.2 C50.2 C51.2 U18.4(VDDP) U18.9(VIN)
GND_PDOC: C39.1 C41.1 C42.1 C43.1 C44.2 C45.2 C46.1 C47.1 Q2.S R20.1 R23.1 R27.1 U16.2(VCC-) U17.3(GND) U18.11(GNDISO) U18.14(GNDISO) U18.16(GNDISO) U18.20(GNDISO)
VDD_PDOC: C41.2 C43.2 C44.1 C45.1 C46.2 C47.2 D7.A D8.K K2.16 R18.2 R21.2 R24.2 R25.2 R26.2 U16.5(VCC+) U17.8(VDD) U18.12(VISO) U18.17(VDDISO)
GL_OUT: K2.9 PDOC.1 ; port GL_OUT
GL_PDOC_IN: K2.13 PDOC.2 ; port GL_PDOC_IN
I2C1_SCL: U18.2(SCL2) ; port SCL
I2C1_SDA: U18.3(SDA2) ; port SDA
PDOC_OK: Q2.G R14.2 U17.6(AIN2)
V_SEL: R26.1 R27.2 U18.13(VSEL)
NetC39_2: C39.2 P10.2 R18.1 U16.4(IIN+) U17.4(AIN0)
NetC42_2: C42.2 R21.1 R22.1(CCW) R22.2(Wiper) U16.3(IN-) U17.5(AIN1)
NetD7_K: D7.K R15.2
NetD8_A: D8.A K2.1 Q2.D R15.1
NetP10_1: P10.1 R20.2
NetR14_1: R14.1 U16.1(OUT)
NetR22_3: R22.3(CW) R23.2
NetR24_1: R24.1 U17.1(ADDR) U17.10(SCL) U18.19(SCL1)
NetR25_1: R25.1 U17.9(SDA) U18.18(SDA1)

Not connected (* = marked no-connect by the designer): K2 4 6 8 11; U17 2(ALERT/RDY) 7(AIN3)

### Notes on the sheet
- https://www.cantherm.com/wp-content/uploads/2017/05/CWF_11x17_OCT_2014_1.pdf
- PDOC
- VEHICLE
- ISOLATED
- The PDOC (Precharge/Discharge Overcurrent) is intended to limit the failure of the precharge resistor by monitoring its temperature in in the case of a failure of a resistor will break the safety loop.
- Section Leader Check:
- Date:
- Title:
- Revision
- Variant
- Project:
- Engineers:
- Sheet
- of
- (in symbol GCM188L81H103KA03D) 0603
- (in symbol GCM188L81H104KA57D) 0603
- (in symbol GRM21BR6YA106KE43L) 0805
- (in symbol RC0603FR-071KL) 0603
- (in symbol RC0603FR-072KL) 0603
- (in symbol RC0603FR-0710KL) 0603
- (in symbol RC0603FR-0720KL) 0603
- (in symbol RC0603JR-075K1L) 0603
- (in symbol RC0603JR-13680RL) 0603

### Library data of the parts
C39 C41-C44 C47 C48 C50 = GCM188L81H104KA57D: as C57 on sheet Microcontroller; Part Number: GCM188L81H104KA57D; Value: 100nF; Digikey Part Number: 490-6049-1-ND
C45 C49 = GRM21BR6YA106KE43L: Manufacturer: muRata; Rated Voltage: 50V; Tolerance: 10%; Material: MLCC; Temperature Rating: X5R; Part Number: GRM21BR6YA106KE43L; Value: 10uF; Digikey Part Number: 490-10514-6-ND
C46 C51 = GCM188L81H103KA03D: Manufacturer: muRata; Rated Voltage: 50V; Tolerance: ±10%; Material: MLCC; Temperature Rating: X8L; Part Number: GCM188L81H103KA03D; Value: 10nF; Digikey Part Number: 490-GCM188L81H103KA03DCT-ND
D7 = SML-210FTT86: as D5 on sheet Green Loop; Part Number: SML-210FTT86; Colour: Green; Digikey Part Number: 511-1285-1-ND; Digikey Link: https://www.digikey.com/product-detail/en/rohm-semiconductor/SML-210FTT86/511-1285-1-ND/637098
D8 = PMEG100T10ELR-QX: as D6 on sheet Green Loop; Part Number: PMEG100T10ELR-QX; Digikey Part Number: 1727-PMEG100T10ELR-QXCT-ND
K2 = J104A2C5VDC.40S: as K1 on sheet Green Loop; Part Number: J104A2C5VDC.40S; Digikey Part Number: 2449-J104A2C5VDC.40S-ND; Digikey Link: https://www.digikey.com.au/en/products/detail/cit-relay-and-switch/J104A2C5VDC-40S/14002119
P10 = B2B-XH-A(LF)(SN): Positions: 2; Pitch: 2.54mm; Angle: 0; Flange: No; Contact: Tin; Part Number: B2B-XH-A(LF)(SN); Row Spacing: 2.54mm; Digikey Part Number: 455-2247-ND; Digikey Link: https://www.digikey.com.au/en/products/detail/jst-sales-america-inc/B2B-XH-A-LF-SN/1651045
PDOC = TH 2.54mm Header 1x2: as BOOT on sheet Microcontroller; Part Number: TH 2.54mm Header 1x2; Pitch: 2.54mm; Row Spacing: 2.54mm
Q2 = SQ2308CES-T1_GE3: as Q1 on sheet Green Loop; Published: 24-Mar-1999; LatestRevisionDate: 29-May-2009; LatestRevisionNote: IPC-7351 Footprint Added.; PackageVersion: Sep-2000; PackageReference: SOT-343; Publisher: Altium Limited; PackageDescription: 4-Pin SOT-343 Package 1.3 mm Pitch, 2.1 mm Lead Span; Part Number: SQ2308CES-T1_GE3; Digikey Part Number: SQ2308CES-T1_GE3CT-ND
R14 = RC0603JR-13680RL: as R13 on sheet Green Loop; Part Number: RC0603JR-13680RL; Value: 680R; Material: FR-07; Digikey Part Number: 13-RC0603JR-13680RLCT-ND
R15 = RC0603FR-071KL: as R12 on sheet Green Loop; Part Number: RC0603FR-071KL; Value: 1k; Material: FR-07; Digikey Part Number: 311-1.00KHRCT-ND
R18 = RC0603FR-072KL: Manufacturer: YAGEO; Tolerance: 0.01; Rated Power: 0.1W; Part Number: RC0603FR-072KL; Value: 2K; Digikey Part Number: 311-2.00KHRCT-ND; Material: FR-07
R20 R21 R23 R27 = RC0603FR-0710KL: as R2 on sheet Microcontroller; Part Number: RC0603FR-0710KL; Value: 10k; Digikey Part Number: 311-10.0KHRCT-ND; Material: FR-07
R22 = 3296W-1-103LF: Manufacturer: Bournes Inc; Tolerance: 0.1; Rated Power: 0.5W; Part Number: 3296W-1-103LF; Value: 10K (Var); Digikey Part Number: 3296W-103LF-ND
R24 R25 = RC0603JR-075K1L: Manufacturer: YAGEO; Tolerance: 0.01; Rated Power: 0.1W; Part Number: RC0603JR-075K1L; Value: 5.1k; Material: FR-07; Digikey Part Number: 311-5.1KGRCT-ND
R26 = RC0603FR-0720KL: Manufacturer: YAGEO; Tolerance: 0.01; Rated Power: 0.1W; Part Number: RC0603FR-0720KL; Value: 20K; Digikey Part Number: 311-20.0KHRCT-ND; Material: FR-07
U16 = CMP-022-000013-1: IC COMP LO PWR SGL V SOT 23-5L; Part Number: TS391ILT
U17 = ADS1115: 16 Bit Analog to Digital Converter 2, 4 Input 1 Sigma-Delta 10-VSSOP; Manufacturer: Texas Instruments; Part Number: ADS1115; Digikey Part Number: 296-38849-1-ND
U18 = CMP-021-000012-1: I²C Digital Isolator 2500Vrms 2 Channel 25kV/µs CMTI 20-SSOP (0.209", 5.30mm Width); Part Number: ADM3260

## Sheet Precharge.SchDoc
size A3; SheetNumber: 10; SheetTotal: 11
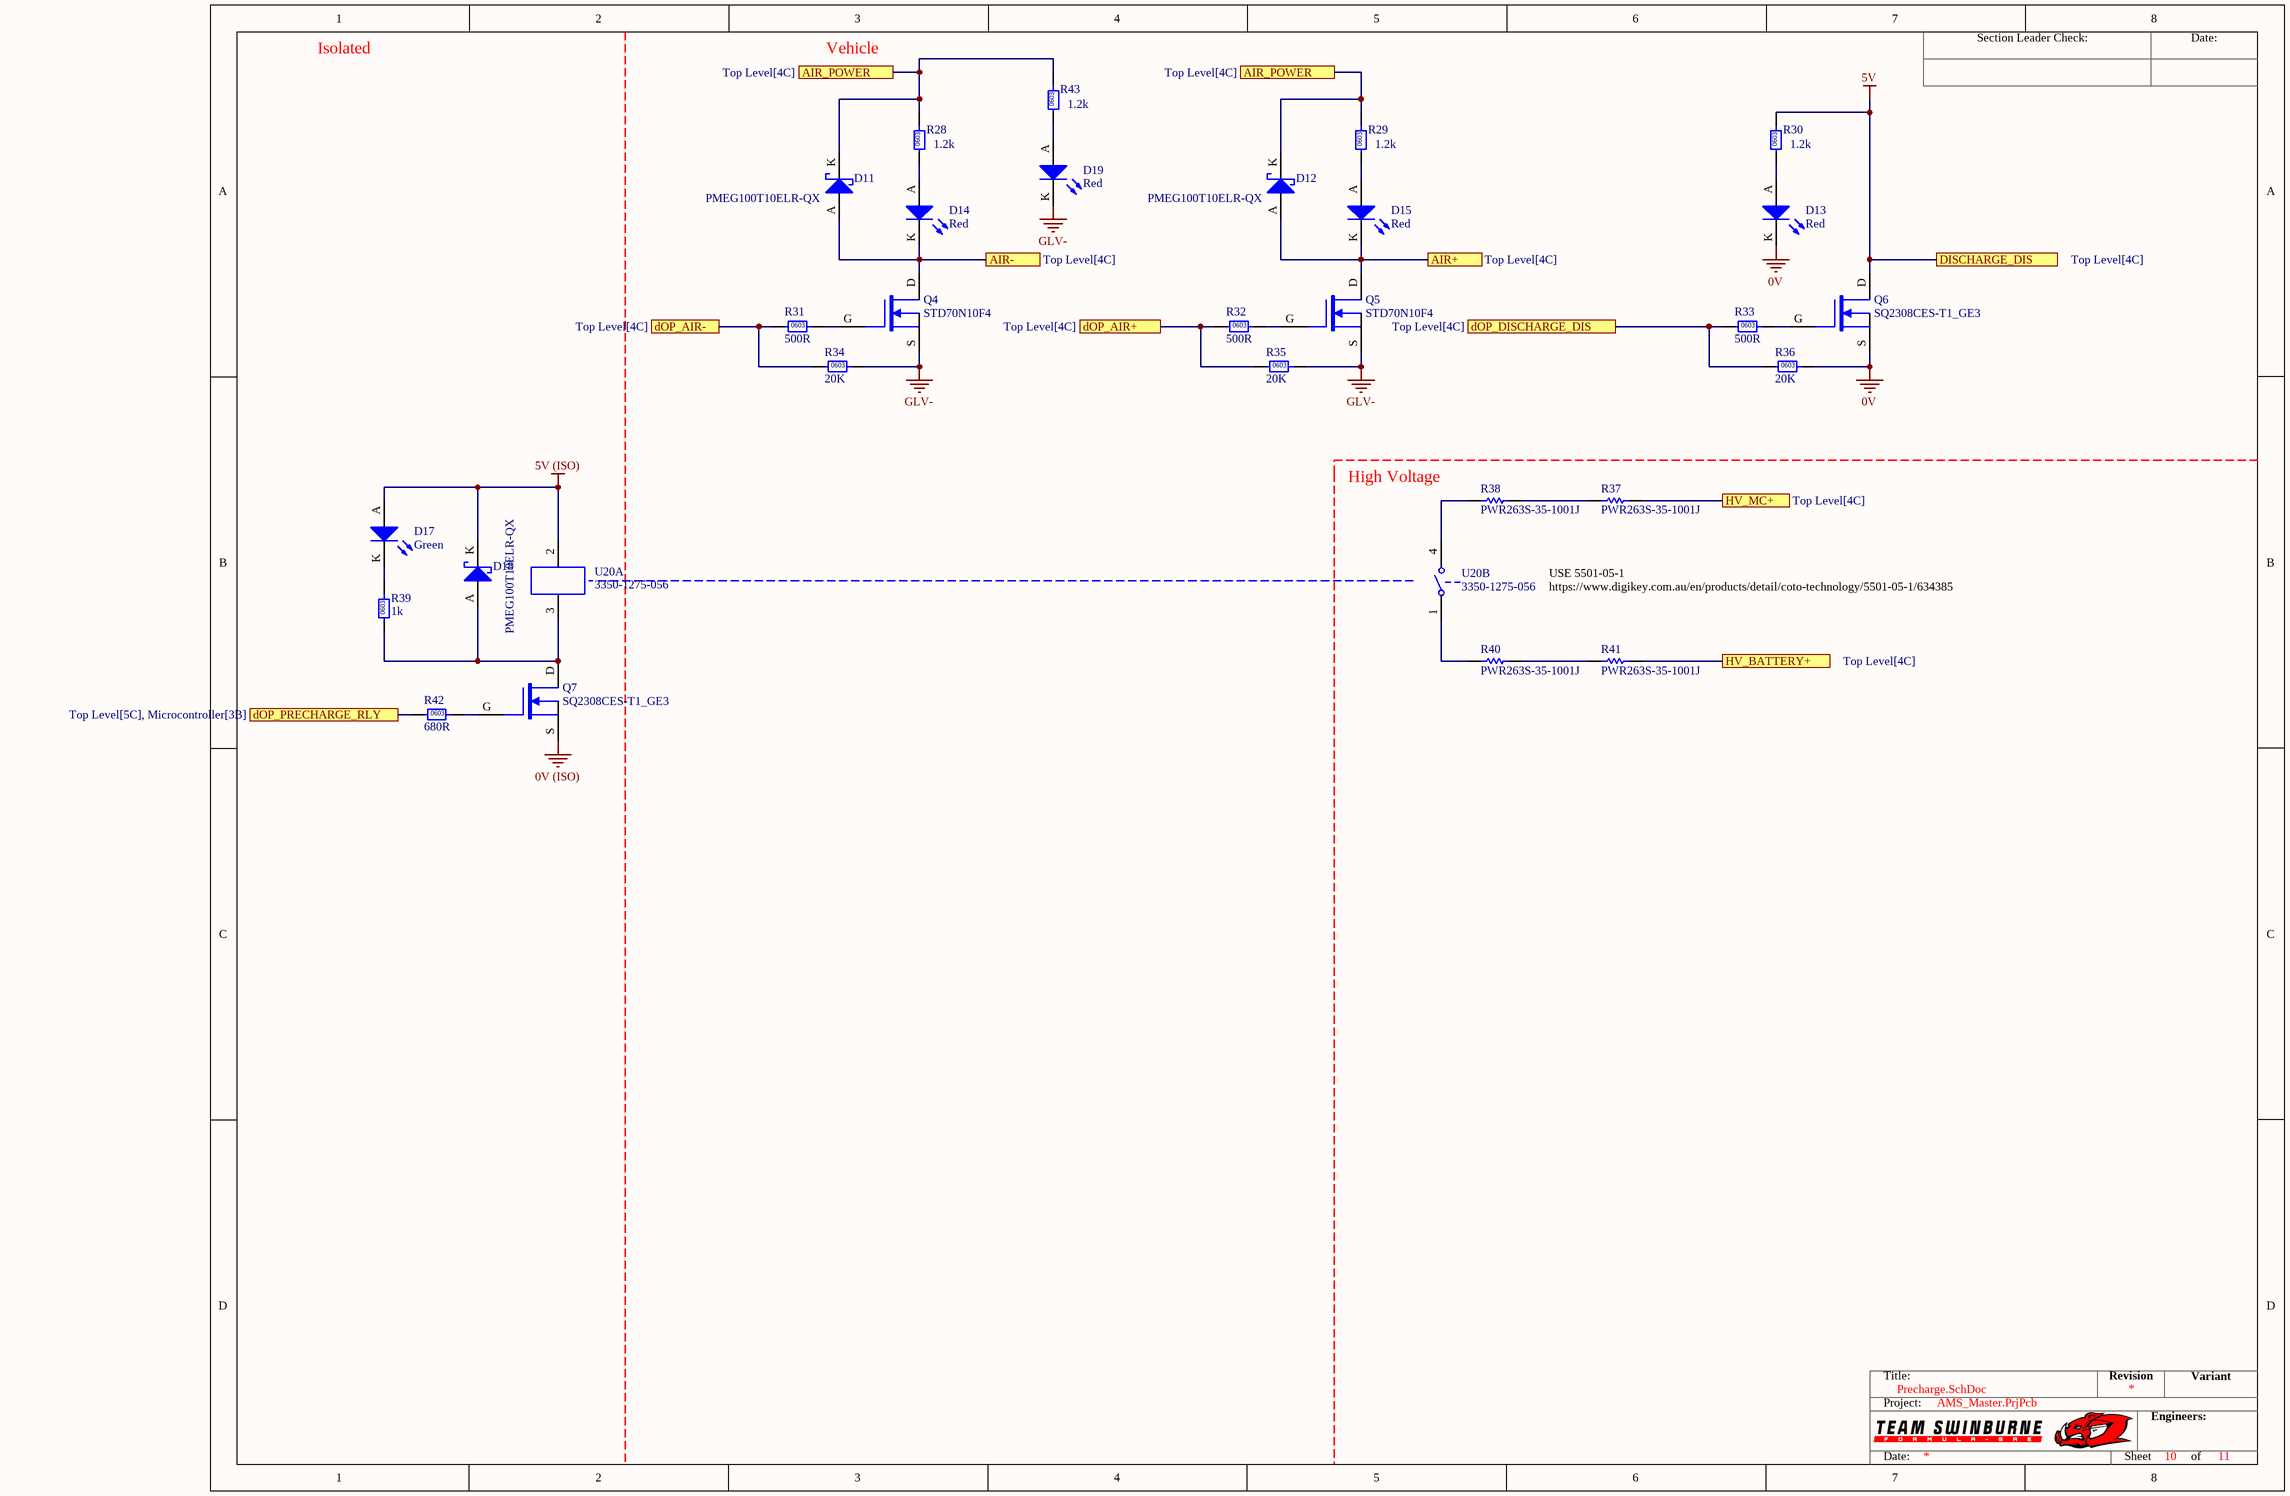
[diagram p5: Precharge.SchDoc]

### Parts
D11  PMEG100T10ELR-QX  [NXP SOD123W]
D12  PMEG100T10ELR-QX  [NXP SOD123W]
D13  Red  [0805 LED]
D14  Red  [0805 LED]
D15  Red  [0805 LED]
D17  Green  [0805 LED]
D18  PMEG100T10ELR-QX  [NXP SOD123W]
D19  Red  [0805 LED]
Q4  STD70N10F4  [STM TO-252 MOSFET]
Q5  STD70N10F4  [STM TO-252 MOSFET]
Q6  SQ2308CES-T1_GE3  [VSHY SOT-23-3]
Q7  SQ2308CES-T1_GE3  [VSHY SOT-23-3]
R28  1.2k  [0603]
R29  1.2k  [0603]
R30  1.2k  [0603]
R31  500R  [0603]
R32  500R  [0603]
R33  500R  [0603]
R34  20K  [0603]
R35  20K  [0603]
R36  20K  [0603]
R37  PWR263S-35-1001J  [B TO-263]
R38  PWR263S-35-1001J  [B TO-263]
R39  1k  [0603]
R40  PWR263S-35-1001J  [B TO-263]
R41  PWR263S-35-1001J  [B TO-263]
R42  680R  [0603]
R43  1.2k  [0603]
U20  3350-1275-056  [CI SPST]  (parts A,B of 2)

### Ports
AIR+ (see Top Level[4C]), AIR- (see Top Level[4C]), AIR_POWER (see Top Level[4C]), DISCHARGE_DIS (see Top Level[4C]), dOP_AIR+ (see Top Level[4C]), dOP_AIR- (see Top Level[4C]), dOP_DISCHARGE_DIS (see Top Level[4C]), dOP_PRECHARGE_RLY (see Top Level[5C], Microcontroller[3B]), HV_BATTERY+ (see Top Level[4C]), HV_MC+ (see Top Level[4C])

### Nets
0V: D13.K Q6.S R36.2
0V (ISO): Q7.S
5V: Q6.D R30.2 ; port DISCHARGE_DIS  [project net DISCHARGE DISABLE]
5V (ISO): D17.A D18.K U20.2
GLV-: D19.K Q4.S Q5.S R34.2 R35.2
AIR+: D12.A D15.K Q5.D ; port AIR+
AIR-: D11.A D14.K Q4.D ; port AIR-
AIR_PWR_HEADER: D11.K D12.K R28.2 R29.2 R43.2 ; port AIR_POWER
dOP_AIR+: R32.1 R35.1 ; port dOP_AIR+
dOP_AIR-: R31.1 R34.1 ; port dOP_AIR-
dOP_DISCHARGE DISABLE: R33.1 R36.1 ; port dOP_DISCHARGE_DIS
dOP_PRECHARGE_RLY: R42.1 ; port dOP_PRECHARGE_RLY
HV Battery+: R41.2 ; port HV_BATTERY+
HV MC+: R37.1 ; port HV_MC+
NetD13_A: D13.A R30.1
NetD14_A: D14.A R28.1
NetD15_A: D15.A R29.1
NetD17_K: D17.K R39.2
NetD18_A: D18.A Q7.D R39.1 U20.3
NetD19_A: D19.A R43.1
NetQ4_G: Q4.G R31.2
NetQ5_G: Q5.G R32.2
NetQ6_G: Q6.G R33.2
NetQ7_G: Q7.G R42.2
NetR37_2: R37.2 R38.1
NetR38_2: R38.2 U20.4
NetR40_1: R40.1 U20.1
NetR40_2: R40.2 R41.1

### Notes on the sheet
- Isolated
- Vehicle
- (near R38) High Voltage
- USE 5501-05-1
- https://www.digikey.com.au/en/products/detail/coto-technology/5501-05-1/634385
- Section Leader Check:
- Date:
- Title:
- Revision
- Variant
- Project:
- Engineers:
- Sheet
- of
- (in symbol RC0603FR-071KL) 0603
- (in symbol RC0603FR-0720KL) 0603
- (in symbol RC0603JR-071K2L) 0603
- (in symbol RC0603JR-13680RL) 0603
- (in symbol RT0603BRD07500RL) 0603

### Library data of the parts
D11 D12 D18 = PMEG100T10ELR-QX: as D6 on sheet Green Loop; Part Number: PMEG100T10ELR-QX; Digikey Part Number: 1727-PMEG100T10ELR-QXCT-ND
D13-D15 D19 = SML-210LTT86: Red LED Indication - Discrete 1.75V 0805 (2012 Metric); Manufacturer: ROHM Semiconductor; Part Number: SML-210LTT86; Colour: Red; Digikey Part Number: 511-1286-1-ND
D17 = SML-210FTT86: as D5 on sheet Green Loop; Part Number: SML-210FTT86; Colour: Green; Digikey Part Number: 511-1285-1-ND; Digikey Link: https://www.digikey.com/product-detail/en/rohm-semiconductor/SML-210FTT86/511-1285-1-ND/637098
Q4 Q5 = STD70N10F4: N-Channel 100V 60A (Tc) 125W (Tc) Surface Mount DPAK; Manufacturer: STMicroelectronics; Published: 24-Mar-1999; LatestRevisionDate: 29-May-2009; LatestRevisionNote: IPC-7351 Footprint Added.; PackageVersion: Sep-2000; PackageReference: SOT-343; Publisher: Altium Limited; PackageDescription: 4-Pin SOT-343 Package 1.3 mm Pitch, 2.1 mm Lead Span; Part Number: STD70N10F4; Type: N-channel; Rated Power: 125W; Digikey Part Number: 497-8806-2-ND
Q6 Q7 = SQ2308CES-T1_GE3: as Q1 on sheet Green Loop; Published: 24-Mar-1999; LatestRevisionDate: 29-May-2009; LatestRevisionNote: IPC-7351 Footprint Added.; PackageVersion: Sep-2000; PackageReference: SOT-343; Publisher: Altium Limited; PackageDescription: 4-Pin SOT-343 Package 1.3 mm Pitch, 2.1 mm Lead Span; Part Number: SQ2308CES-T1_GE3; Digikey Part Number: SQ2308CES-T1_GE3CT-ND
R28-R30 R43 = RC0603JR-071K2L: Manufacturer: YAGEO; Tolerance: 0.01; Rated Power: 0.1W; Part Number: RC0603JR-071K2L; Value: 1.2k; Material: FR-07; Digikey Part Number: 311-1.2KGRCT-ND
R31-R33 = RT0603BRD07500RL: Manufacturer: YAGEO; Tolerance: 0.01; Rated Power: 0.1W; Part Number: RT0603BRD07500RL; Value: 500R; Material: FR-07; Digikey Part Number: 13-RT0603BRD07500RL-ND
R34-R36 = RC0603FR-0720KL: as R26 on sheet PDOC; Part Number: RC0603FR-0720KL; Value: 20K; Material: FR-07; Digikey Part Number: 311-20.0KHRCT-ND
R37 R38 R40 R41 = CMP-037-000402-1: Manufacturer: Bournes Inc; Value: 1k; Rated Voltage: 35W; Tolerance: 0.05; Part Number: PWR263S-35-1001J; Digikey Part Number: PWR263S-35-1001J-ND
R39 = RC0603FR-071KL: as R12 on sheet Green Loop; Part Number: RC0603FR-071KL; Value: 1k; Material: FR-07; Digikey Part Number: 311-1.00KHRCT-ND
R42 = RC0603JR-13680RL: as R13 on sheet Green Loop; Part Number: RC0603JR-13680RL; Value: 680R; Material: FR-07; Digikey Part Number: 13-RC0603JR-13680RLCT-ND
U20 = 3350-1275-056: RELAY REED HV SPST 200W 3A 5V (NO); Manufacturer: Comus International; Part Number: 3350-1275-056; Digikey Part Number: 1835-1036-ND; Digikey Link: https://www.digikey.com.au/product-detail/en/comus-international/3350-1275-056/1835-1036-ND/7515918

## Sheet Charge Interface.SchDoc
size A4; SheetNumber: 3; SheetTotal: 10
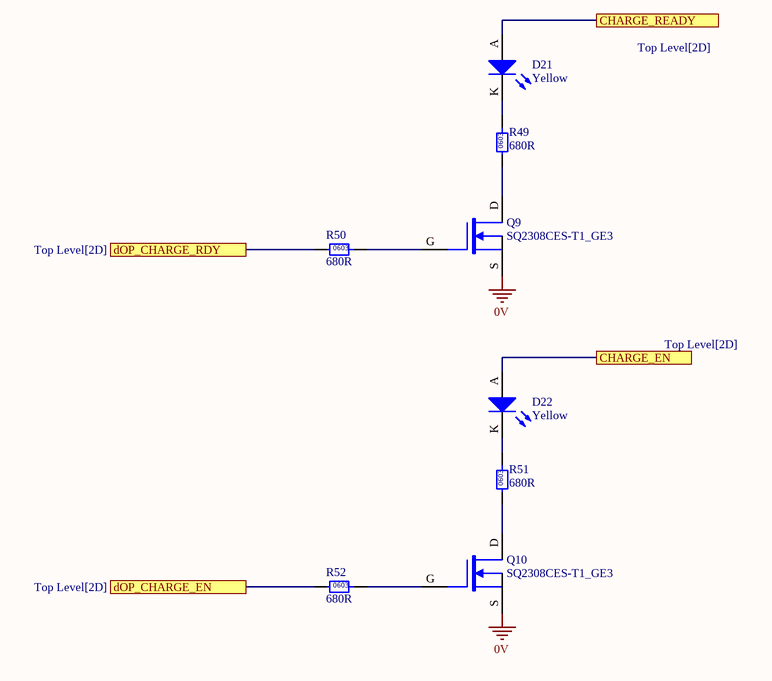
[diagram p6: Charge Interface.SchDoc]

### Parts
D21  Yellow  [0805 LED]
D22  Yellow  [0805 LED]
Q9  SQ2308CES-T1_GE3  [VSHY SOT-23-3]
Q10  SQ2308CES-T1_GE3  [VSHY SOT-23-3]
R49  680R  [0603]
R50  680R  [0603]
R51  680R  [0603]
R52  680R  [0603]

### Ports
CHARGE_EN (see Top Level[2D]), CHARGE_READY (see Top Level[2D]), dOP_CHARGE_EN (see Top Level[2D]), dOP_CHARGE_RDY (see Top Level[2D])

### Nets
0V: Q9.S Q10.S
Charge_En: D22.A ; port CHARGE_EN
Charge_Ready: D21.A ; port CHARGE_READY
dOP_CHARGE_EN: R52.1 ; port dOP_CHARGE_EN
dOP_CHARGE_RDY: R50.1 ; port dOP_CHARGE_RDY
NetD21_K: D21.K R49.2
NetD22_K: D22.K R51.2
NetQ9_D: Q9.D R49.1
NetQ9_G: Q9.G R50.2
NetQ10_D: Q10.D R51.1
NetQ10_G: Q10.G R52.2

### Notes on the sheet
- Section Leader Check:
- Date:
- Title:
- Revision
- Variant
- Project:
- Engineers:
- Sheet
- of
- (in symbol RC0603JR-13680RL) 0603

### Library data of the parts
D21 D22 = SML-211YTT86: Yellow LED Indication - Discrete 1.75V 0805 (2012 Metric); Manufacturer: ROHM Semiconductor; Part Number: SML-211YTT86; Colour: Yellow; Digikey Part Number: 511-1293-1-ND
Q9 Q10 = SQ2308CES-T1_GE3: as Q1 on sheet Green Loop; Published: 24-Mar-1999; LatestRevisionDate: 29-May-2009; LatestRevisionNote: IPC-7351 Footprint Added.; PackageVersion: Sep-2000; PackageReference: SOT-343; Publisher: Altium Limited; PackageDescription: 4-Pin SOT-343 Package 1.3 mm Pitch, 2.1 mm Lead Span; Part Number: SQ2308CES-T1_GE3; Digikey Part Number: SQ2308CES-T1_GE3CT-ND
R49-R52 = RC0603JR-13680RL: as R13 on sheet Green Loop; Part Number: RC0603JR-13680RL; Value: 680R; Material: FR-07; Digikey Part Number: 13-RC0603JR-13680RLCT-ND

## Sheet Power.SchDoc
size A3; SheetNumber: 9; SheetTotal: 11
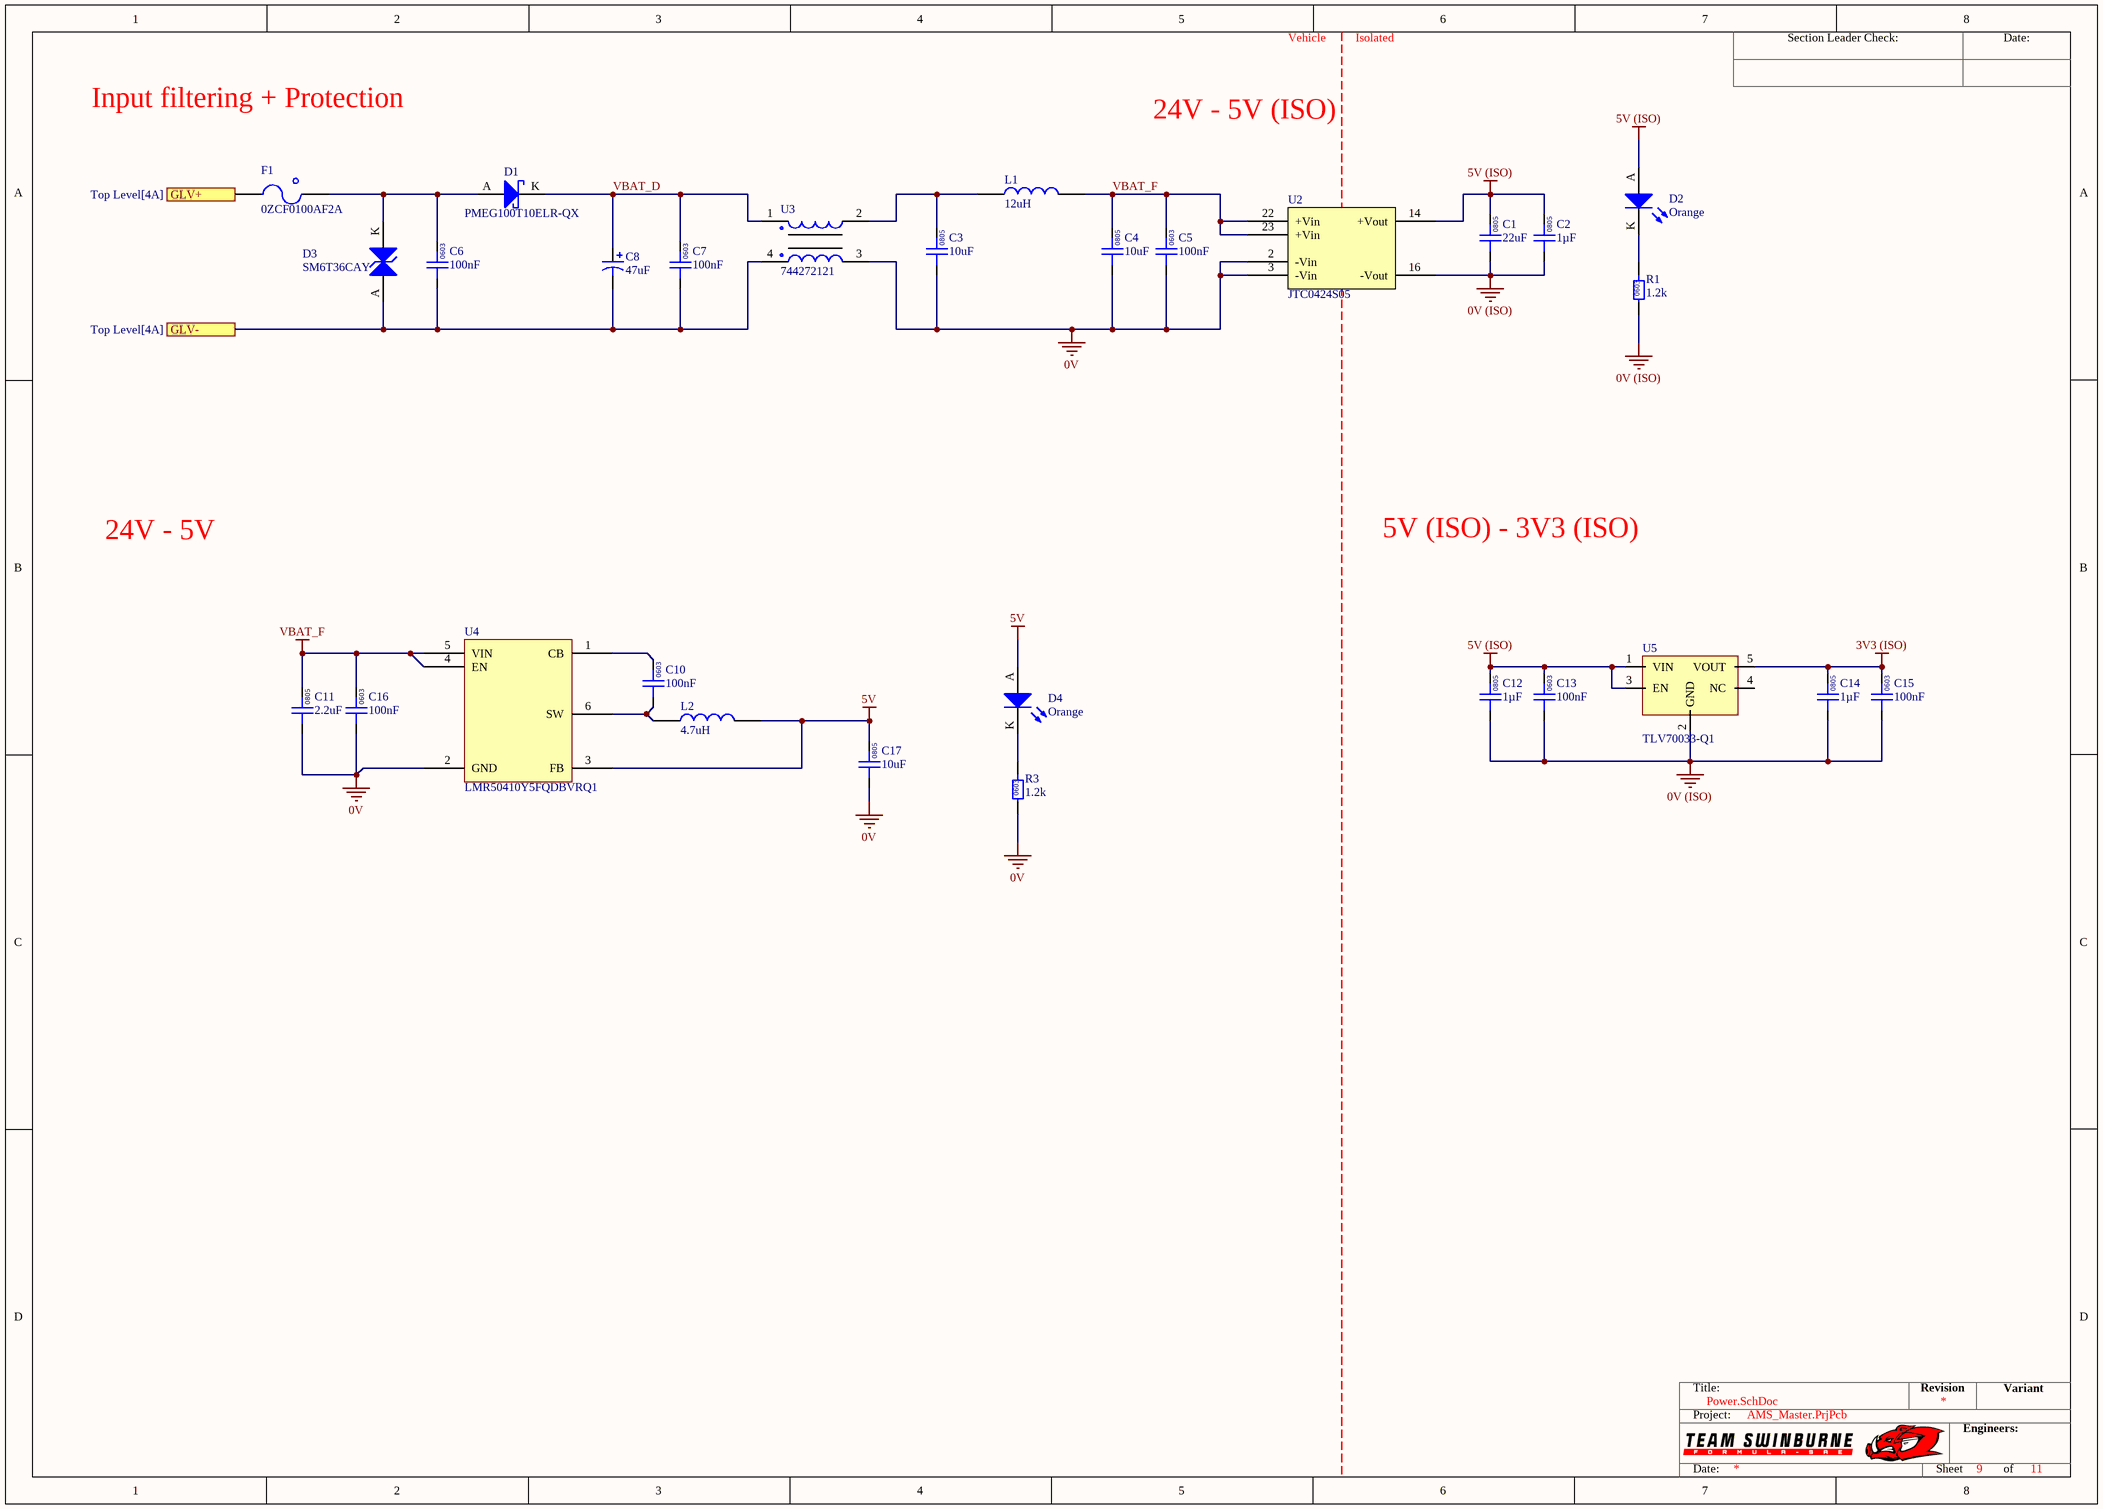
[diagram p7: Power.SchDoc]

### Parts
C1  22uF  [0805]
C2  1µF  [0805]
C3  10uF  [0805]
C4  10uF  [0805]
C5  100nF  [0603]
C6  100nF  [0603]
C7  100nF  [0603]
C8  47uF  [CHEMI-CON ELCO]
C10  100nF  [0603]
C11  2.2uF  [0805]
C12  1µF  [0805]
C13  100nF  [0603]
C14  1µF  [0805]
C15  100nF  [0603]
C16  100nF  [0603]
C17  10uF  [0805]
D1  PMEG100T10ELR-QX  [NXP SOD123W]
D2  Orange  [0805 LED]
D3  SM6T36CAY  [ST SMB DIODE]
D4  Orange  [0805 LED]
F1  0ZCF0100AF2A  [2920]
L1  12uH  [1812]
L2  4.7uH  [SRN3015TA-4R7M]
R1  1.2k  [0603]
R3  1.2k  [0603]
U2  JTC0424S05  [24-DIP Module, 7 Leads]
U3  744272121  [Wurth 4-PC Pad]
U4  LMR50410Y5FQDBVRQ1  [TI-SOT23-6]
U5  TLV70033-Q1  [TI SOT-23-5]

### Ports
GLV+ (see Top Level[4A]), GLV- (see Top Level[4A])

### Nets
0V: C3.1 C4.1 C5.1 C11.1 C16.1 C17.1 R3.1 U2.2(-Vin) U2.3(-Vin) U3.3 U4.2(GND)
0V (ISO): C1.1 C2.1 C12.1 C13.1 C14.1 C15.1 R1.1 U2.16(-Vout) U5.2(GND)
3V3 (ISO): C14.2 C15.2 U5.5(VOUT)
5V: C17.2 D4.A L2.1 U4.3(FB)  [project net DISCHARGE DISABLE]
5V (ISO): C1.2 C2.2 C12.2 C13.2 D2.A U2.14(+Vout) U5.1(VIN) U5.3(EN)
GLV+: F1.1 ; port GLV+
GLV-: C6.1 C7.1 C8.1 D3.A U3.4 ; port GLV-
VBAT_F: C4.2 C5.2 C11.2 C16.2 L1.1 U2.22(+Vin) U2.23(+Vin) U4.4(EN) U4.5(VIN)
VBAT_D: C7.2 C8.2 D1.K U3.1
NetC3_2: C3.2 L1.2 U3.2
NetC6_2: C6.2 D1.A D3.K F1.2
NetC10_1: C10.1 L2.2 U4.6(SW)
NetC10_2: C10.2 U4.1(CB)
NetD2_K: D2.K R1.2
NetD4_K: D4.K R3.2

Not connected (* = marked no-connect by the designer): U5 4(NC)

### Notes on the sheet
- Vehicle
- Isolated
- Input filtering + Protection
- 24V - 5V (ISO)
- 24V - 5V
- 5V (ISO) - 3V3 (ISO)
- Section Leader Check:
- Date:
- Title:
- Revision
- Variant
- Project:
- Engineers:
- Sheet
- of
- (in symbol GCM21BR71H105KA03L) 0805
- (in symbol GCM188L81H104KA57D) 0603
- (in symbol GRM21BR6YA106KE43L) 0805
- (in symbol GRM21BR61A226ME51L) 0805
- (in symbol GRM21BR71E225KE11L) 0805
- (in symbol RC0603JR-071K2L) 0603

### Library data of the parts
C1 = GRM21BR61A226ME51L: as C20 on sheet CAN; Part Number: GRM21BR61A226ME51L; Value: 22uF; Digikey Part Number: 490-10511-1-ND
C2 C12 C14 = GCM21BR71H105KA03L: as C62 on sheet Microcontroller; Part Number: GCM21BR71H105KA03L; Value: 1µF; Digikey Part Number: 490-10675-1-ND
C3 C4 C17 = GRM21BR6YA106KE43L: as C45 on sheet PDOC; Part Number: GRM21BR6YA106KE43L; Value: 10uF; Digikey Part Number: 490-10514-6-ND
C5-C7 C10 C13 C15 C16 = GCM188L81H104KA57D: as C57 on sheet Microcontroller; Part Number: GCM188L81H104KA57D; Value: 100nF; Digikey Part Number: 490-6049-1-ND
C8 = HHXA350ARA470MF61G: Manufacturer: Chemi-Con; Rated Voltage: 35V; Tolerance: 20%; Material: Aluminium Electrolytic; Temperature Rating: 125C; Part Number: HHXA350ARA470MF61G; Value: 47uF
C11 = GRM21BR71E225KE11L: Manufacturer: Murata Electronics; Rated Voltage: 25V; Tolerance: ±10%; Material: MLCC; Temperature Rating: X7R; Part Number: GRM21BR71E225KE11L; Value: 2.2uF; Digikey Part Number: 490-14467-2-ND
D1 = PMEG100T10ELR-QX: as D6 on sheet Green Loop; Part Number: PMEG100T10ELR-QX; Digikey Part Number: 1727-PMEG100T10ELR-QXCT-ND
D2 D4 = SML-211DTT86: Orange LED Indication - Discrete 1.75V 0805 (2012 Metric); Manufacturer: ROHM Semiconductor; Part Number: SML-211DTT86; Colour: Orange; Digikey Part Number: 511-1291-1-ND
D3 = SM6T36CAY: Manufacturer: STMicroelectronics; Forward Voltage: 30.8 V; Rated Power: 600W; Part Number: SM6T36CAY; Breakdown Voltage: 30.8 V; Digikey Part Number: 497-10804-1-ND
F1 = 0ZCF0100AF2A: PTC RESET FUSE 60V 1A 292; Manufacturer: Littelfuse Inc.; Part Number: 0ZCF0100AF2A; Digikey Part Number: 507-2070-1-ND; Digikey Link: https://www.digikey.com/product-detail/en/bel-fuse-inc/0ZCF0100AF2A/507-2070-1-ND/6210547
L1 = RLS-126: Manufacturer: Recom; Tolerance: 0.2; Impedance: 230mOhm; Rated Current: 0.8 A; Material: Wirewound; Part Number: RLS-126; Value: 12uH; Digikey Part Number: 945-3429-ND
L2 = SRN4018-4R7M: Manufacturer: Bourns; Tolerance: 0.2; Impedance: 84mOhms; Rated Current: 1.9A; Material: Wirewound; Part Number: SRN4018-4R7M; Value: 4.7uH; Digikey Part Number: SRN3015TA-4R7MCT-ND
R1 R3 = RC0603JR-071K2L: as R28 on sheet Precharge; Part Number: RC0603JR-071K2L; Value: 1.2k; Material: FR-07; Digikey Part Number: 311-1.2KGRCT-ND
U2 = JTC0424S05: DC DC CONVERTER 5V 4W; Manufacturer: XP Power; Input Voltage: 9V-36V; Efficiency: 0.79; Isolation: Isolated; Part Number: JTC0424S05; Output Voltage: 5V; Output Power: 4W; Digikey Part Number: JTC0424S05-ND; Digikey Link: https://www.digikey.com/products/en?keywords=%20JTC0424S05
U3 = 744272121: Manufacturer: Wurth Electronics Inc; Value: 120uH @ 100kHz; Impedance: 460 Ohms @ 30MHz; Rated Current: 2.5 A; Part Number: 744272121; Material: Wirewound; Digikey Part Number: 732-1489-1-ND
U4 = LMR50410-Q1: IC REG BUCK 5V 1A SOT23-6; Manufacturer: Texas Instruments; Input Voltage: 4-36V; Part Number: LMR50410-Q1; Output Voltage: 5V; Output Current: 1A; Digikey Part Number: 296-LMR50410Y5FQDBVRQ1CT-ND
U5 = TLV70033-Q1: IC REG LINEAR 3.3V 200MA SOT23-5; Manufacturer: Texas Instruments; Input Voltage: 2 to 5.5 V; Output Current: 0.2 A; Part Number: TLV70033-Q1; Output Voltage: 3.3 V; Digikey Part Number: 296-27780-1-ND

## Sheet ISOSPI.SchDoc
size A4; SheetNumber: 6; SheetTotal: 11
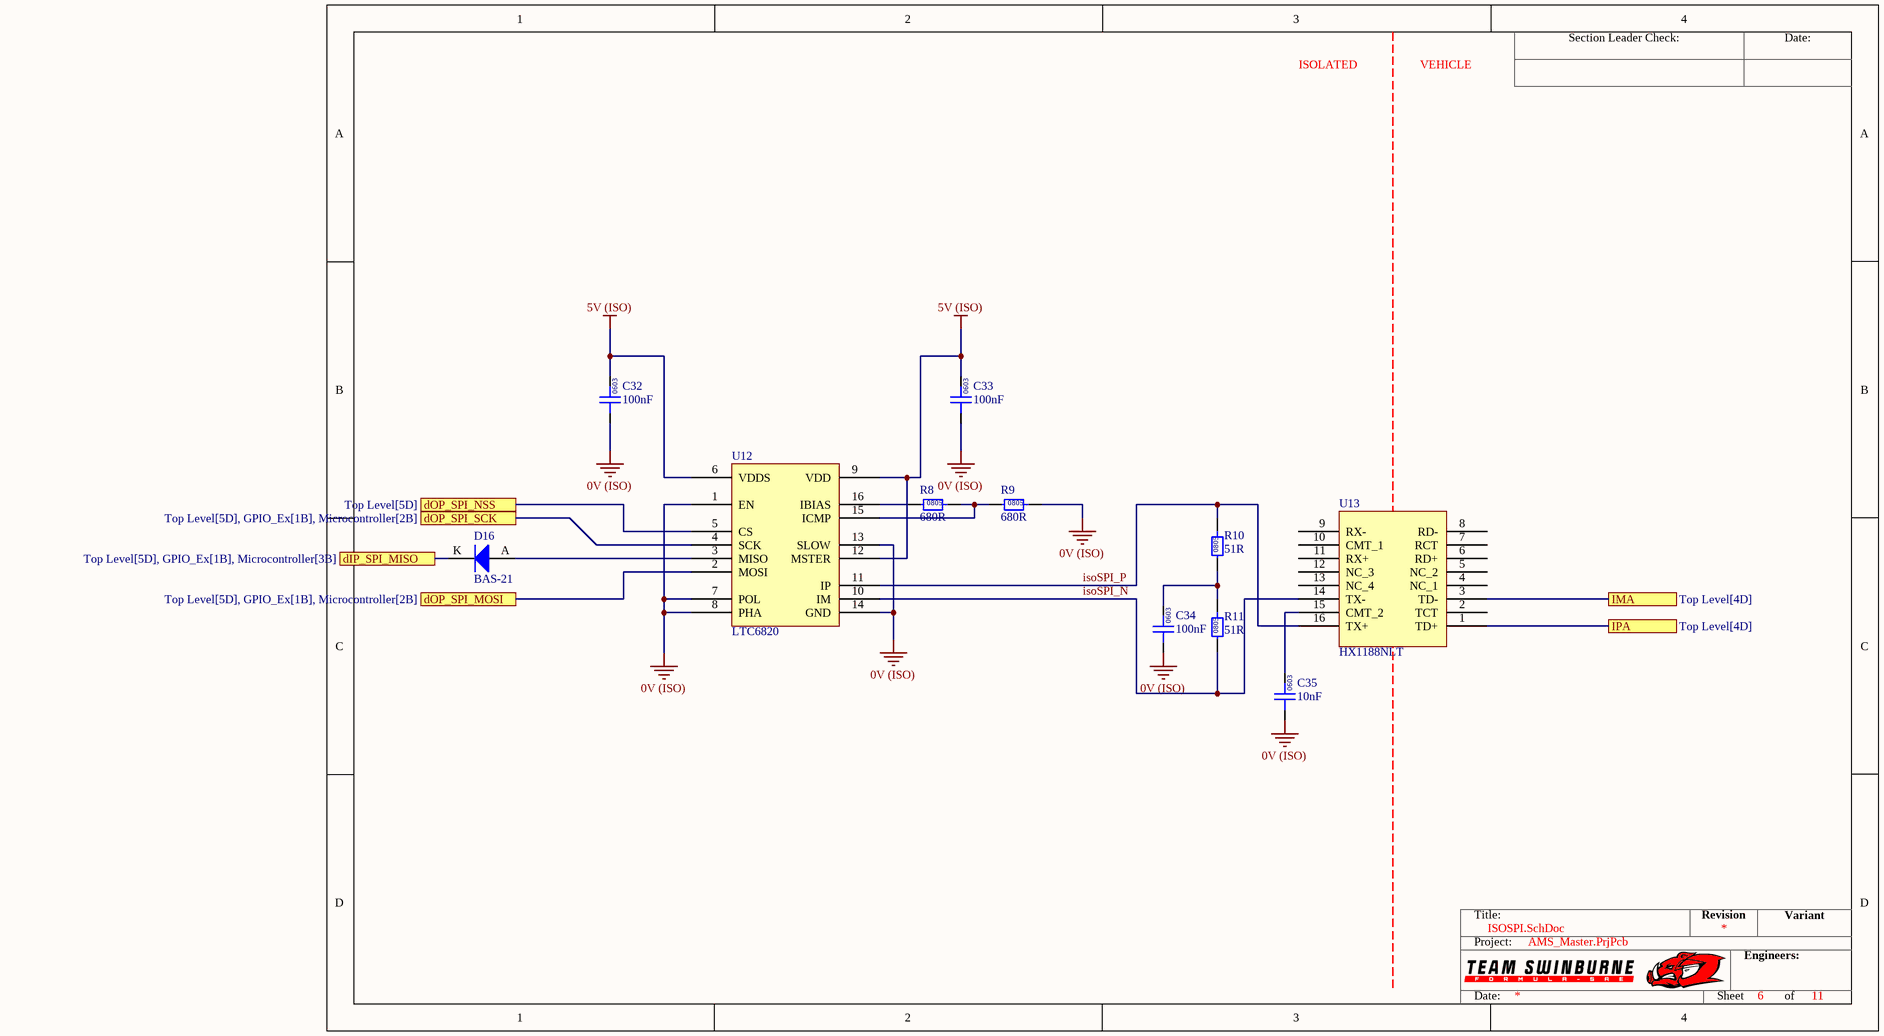
[diagram p8: ISOSPI.SchDoc]

### Parts
C32  100nF  [0603]
C33  100nF  [0603]
C34  100nF  [0603]
C35  10nF  [0603]
D16  BAS-21  [NEXPERIA_SOT23]
R8  680R  [0805]
R9  680R  [0805]
R10  51R  [0805]
R11  51R  [0805]
U12  LTC6820  [WFQN-16]
U13  HX1188NLT  [HX1188NL]

### Ports
dIP_SPI_MISO (see Top Level[5D], GPIO_Ex[1B], Microcontroller[3B]), dOP_SPI_MOSI (see Top Level[5D], GPIO_Ex[1B], Microcontroller[2B]), dOP_SPI_NSS (see Top Level[5D]), dOP_SPI_SCK (see Top Level[5D], GPIO_Ex[1B], Microcontroller[2B]), IMA (see Top Level[4D]), IPA (see Top Level[4D])

### Nets
0V (ISO): C32.1 C33.1 C34.1 C35.1 R9.2 U12.1(EN) U12.7(POL) U12.8(PHA) U12.13(SLOW) U12.14(GND)
5V (ISO): C32.2 C33.2 U12.6(VDDS) U12.9(VDD) U12.12(MSTER)
dIP_SPI_MISO: D16.K ; port dIP_SPI_MISO
dOP_isoSPI_nSS: U12.5(CS) ; port dOP_SPI_NSS
dOP_SPI_MOSI: U12.2(MOSI) ; port dOP_SPI_MOSI
dOP_SPI_SCK: U12.4(SCK) ; port dOP_SPI_SCK
ISO_SPI_N: U13.1(TD+) ; port IPA
ISO_SPI_P: U13.3(TD-) ; port IMA
isoSPI_N: R11.1 U12.10(IM) U13.14(TX-)
isoSPI_P: R10.2 U12.11(IP) U13.16(TX+)
NetC34_2: C34.2 R10.1 R11.2
NetC35_2: C35.2 U13.15(CMT_2)
NetD16_A: D16.A U12.3(MISO)
NetR8_1: R8.1 U12.16(IBIAS)
NetR8_2: R8.2 R9.1 U12.15(ICMP)

Not connected (* = marked no-connect by the designer): U13 2(TCT) 4(NC_1) 5(NC_2) 6(RD+) 7(RCT) 8(RD-) 9(RX-) 10(CMT_1) 11(RX+) 12(NC_3) 13(NC_4)

### Notes on the sheet
- ISOLATED
- VEHICLE
- Section Leader Check:
- Date:
- Title:
- Revision
- Variant
- Project:
- Engineers:
- Sheet
- of
- (in symbol GCM188L81H103KA03D) 0603
- (in symbol GCM188L81H104KA57D) 0603
- (in symbol RC0805FR0751RL) 0805
- (in symbol RC0805FR07680RL) 0805

### Library data of the parts
C32-C34 = GCM188L81H104KA57D: as C57 on sheet Microcontroller; Part Number: GCM188L81H104KA57D; Value: 100nF; Digikey Part Number: 490-6049-1-ND
C35 = GCM188L81H103KA03D: as C46 on sheet PDOC; Part Number: GCM188L81H103KA03D; Value: 10nF; Digikey Part Number: 490-GCM188L81H103KA03DCT-ND
D16 = BAS-21: Manufacturer: Nexperia USA Inc.; Forward Voltage: 1.0V; Breakdown Voltage: 250V; Rated Power: 250mW; Part Number: BAS-21
R8 R9 = RC0805FR07680RL: Manufacturer: YAGEO; Tolerance: 0.01; Rated Power: 0.125W; Part Number: RC0805FR07680RL; Value: 680R; Material: FR-07; Digikey Part Number: 311-680CRCT-ND
R10 R11 = RC0805FR0751RL: Manufacturer: YAGEO; Tolerance: 0.01; Rated Power: 0.125W; Part Number: RC0805FR0751RL; Value: 51R; Material: FR-07; Digikey Part Number: 311-51.0CRCT-ND
U12 = LTC6820: isoSPI Transceiver; Manufacturer: Analogue Devices; Part Number: LTC6820
U13 = HX1188NL: MODULE XFRMR SGL ETHR LAN 16SOIC; Manufacturer: Analogue Devices; Part Number: HX1188NL

## Sheet GPIO_Ex.SchDoc
size A4; SheetNumber: 11; SheetTotal: 11
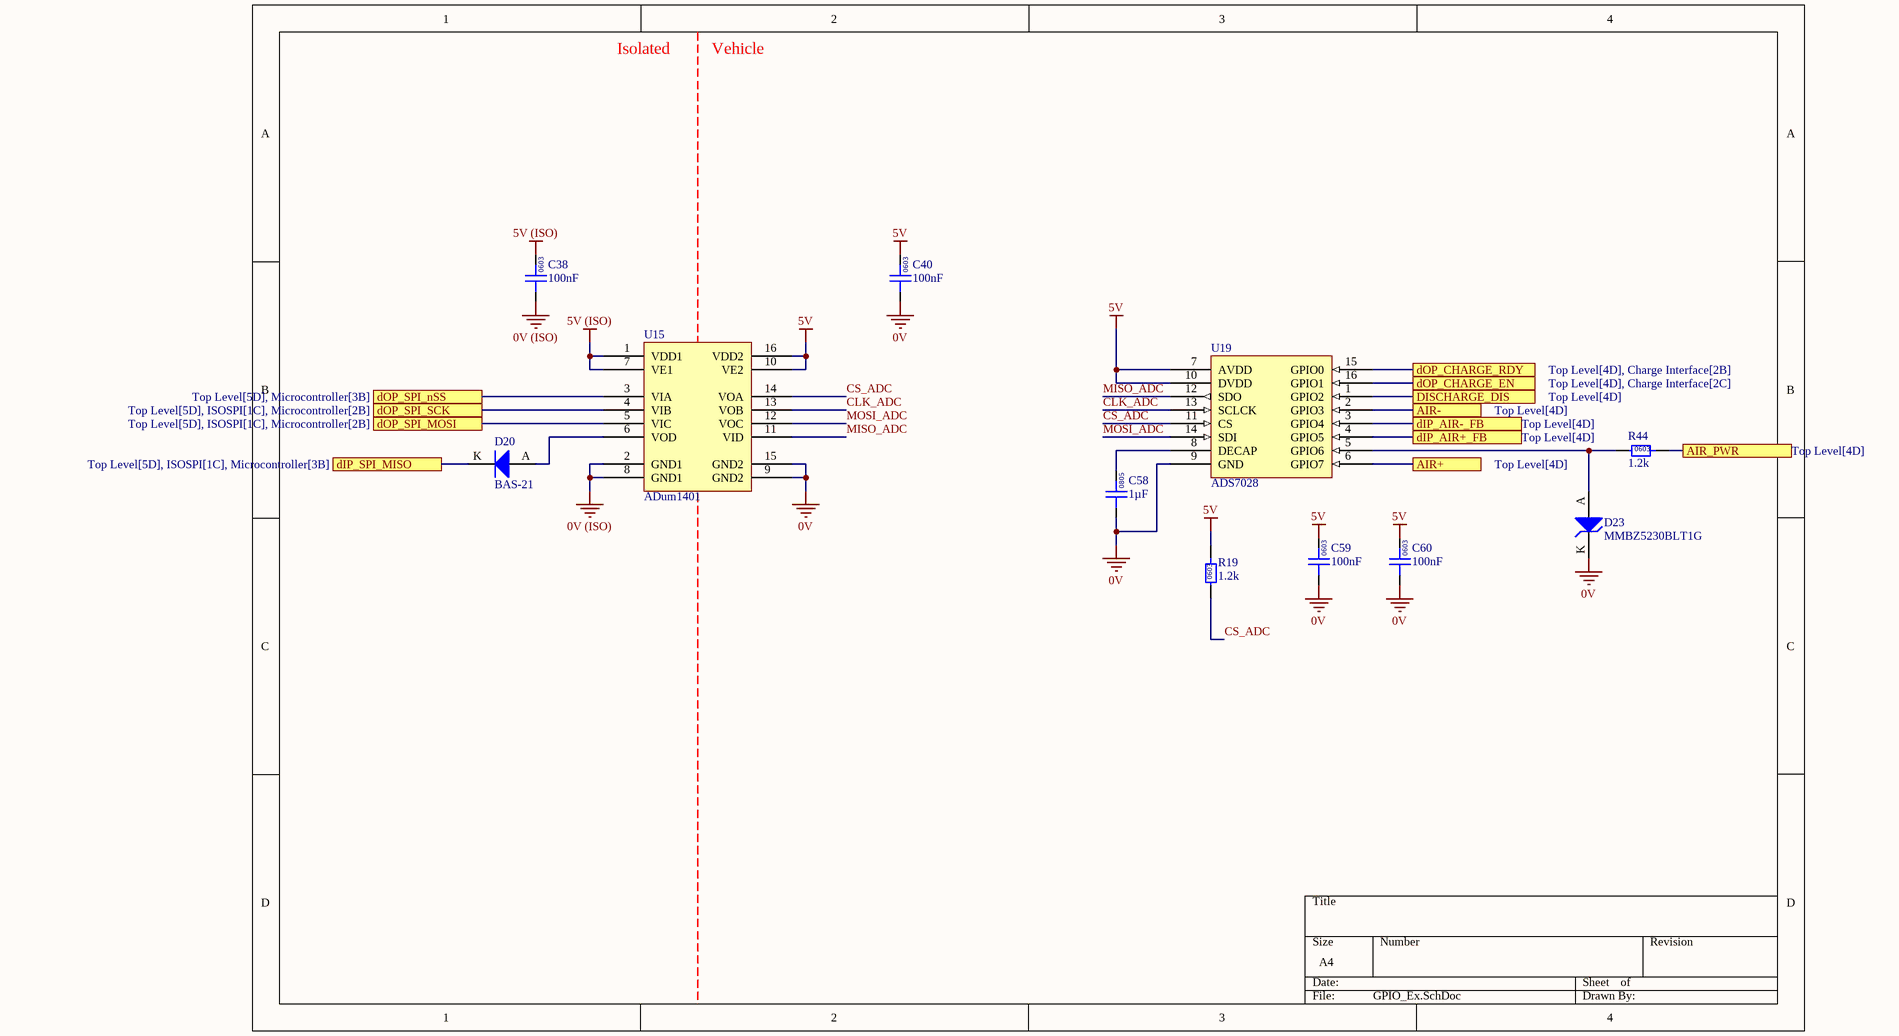
[diagram p9: GPIO_Ex.SchDoc]

### Parts
C38  100nF  [0603]
C40  100nF  [0603]
C58  1µF  [0805]
C59  100nF  [0603]
C60  100nF  [0603]
D20  BAS-21  [NEXPERIA_SOT23]
D23  MMBZ5230BLT1G  [NEXPERIA_SOT23]
R19  1.2k  [0603]
R44  1.2k  [0603]
U15  ADum1401  [AD 16-SOIC]
U19  ADS7028  [WFQN-16]

### Ports
AIR+ (see Top Level[4D]), AIR- (see Top Level[4D]), AIR_PWR (see Top Level[4D]), dIP_AIR+_FB (see Top Level[4D]), dIP_AIR-_FB (see Top Level[4D]), dIP_SPI_MISO (see Top Level[5D], ISOSPI[1C], Microcontroller[3B]), DISCHARGE_DIS (see Top Level[4D]), dOP_CHARGE_EN (see Top Level[4D], Charge Interface[2C]), dOP_CHARGE_RDY (see Top Level[4D], Charge Interface[2B]), dOP_SPI_MOSI (see Top Level[5D], ISOSPI[1C], Microcontroller[2B]), dOP_SPI_nSS (see Top Level[5D], Microcontroller[3B]), dOP_SPI_SCK (see Top Level[5D], ISOSPI[1C], Microcontroller[2B])

### Nets
0V: C40.1 C58.1 C59.1 C60.1 D23.K U15.9(GND2) U15.15(GND2) U19.9(GND)
0V (ISO): C38.1 U15.2(GND1) U15.8(GND1)
5V: C40.2 C59.2 C60.2 R19.2 U15.10(VE2) U15.16(VDD2) U19.7(AVDD) U19.10(DVDD)  [project net DISCHARGE DISABLE]
5V (ISO): C38.2 U15.1(VDD1) U15.7(VE1)
AIR_PWR_HEADER: R44.2 ; port AIR_PWR
CLK_ADC: U15.13(VOB) U19.13(SCLCK)
CS_ADC: R19.1 U15.14(VOA) U19.11(CS)
dIP_AIR+_FB: U19.4(GPIO5) ; port dIP_AIR+_FB
dIP_AIR-_FB: U19.3(GPIO4) ; port dIP_AIR-_FB
dIP_SPI_MISO: D20.K ; port dIP_SPI_MISO
dOP_AIR+: U19.6(GPIO7) ; port AIR+
dOP_AIR-: U19.2(GPIO3) ; port AIR-
dOP_CHARGE_EN: U19.16(GPIO1) ; port dOP_CHARGE_EN
dOP_CHARGE_RDY: U19.15(GPIO0) ; port dOP_CHARGE_RDY
dOP_DISCHARGE DISABLE: U19.1(GPIO2) ; port DISCHARGE_DIS
dOP_SPI_MOSI: U15.5(VIC) ; port dOP_SPI_MOSI
dOP_SPI_nSS: U15.3(VIA) ; port dOP_SPI_nSS
dOP_SPI_SCK: U15.4(VIB) ; port dOP_SPI_SCK
MISO_ADC: U15.11(VID) U19.12(SDO)
MOSI_ADC: U15.12(VOC) U19.14(SDI)
NetC58_2: C58.2 U19.8(DECAP)
NetD20_A: D20.A U15.6(VOD)
NetD23_A: D23.A R44.1 U19.5(GPIO6)

### Notes on the sheet
- Isolated
- Vehicle
- (in symbol GCM21BR71H105KA03L) 0805
- (in symbol GCM188L81H104KA57D) 0603
- (in symbol RC0603JR-071K2L) 0603

### Library data of the parts
C38 C40 C59 C60 = GCM188L81H104KA57D: as C57 on sheet Microcontroller; Part Number: GCM188L81H104KA57D; Value: 100nF; Digikey Part Number: 490-6049-1-ND
C58 = GCM21BR71H105KA03L: as C62 on sheet Microcontroller; Part Number: GCM21BR71H105KA03L; Value: 1µF; Digikey Part Number: 490-10675-1-ND
D20 = BAS-21: as D16 on sheet ISOSPI; Part Number: BAS-21
D23 = MMBZ5230BLT1G: Manufacturer: onsemi; Breakdown Voltage: 4.7V; Rated Power: 225mW; Part Number: MMBZ5230BLT1G; Digikey Part Number: MMBZ5230BLT1GOSTR-ND
R19 R44 = RC0603JR-071K2L: as R28 on sheet Precharge; Part Number: RC0603JR-071K2L; Value: 1.2k; Material: FR-07; Digikey Part Number: 311-1.2KGRCT-ND
U15 = ADuM1401: General Purpose Digital Isolator 2500Vrms 4 Channel 1Mbps 25kV/µs CMTI 16-SOIC (0.295", 7.50mm Width); Manufacturer: Analog Devices; Complex IC: 0; Part Number: ADuM1401
U19 = ADS7028IRTER: IC ADC 12BIT SAR 16WQFN; Manufacturer: Texas Instruments; Part Number: ADS7028IRTER; Digikey Part Number: ADS7028IRTER; Digikey Link: https://www.digikey.com.au/en/products/detail/texas-instruments/ADS7028IRTER/12696020?s=N4IgTCBcDaIIIBEDKB2ADGAHASQEoBUBRXEAXQF8g

## Nets that join several sheets
0V: Top Level (P3.3 P14.1), CAN (16 pins), Green Loop (C36.1 Q1.S U14.4), Precharge (D13.K Q6.S R36.2), Charge Interface (Q9.S Q10.S), Power (11 pins), GPIO_Ex (8 pins)
0V (ISO): Microcontroller (16 pins), CAN (C19.1 C26.1 U6.4 U9.4), Green Loop (C37.1 Q3.S U14.5), PDOC (9 pins), Precharge (Q7.S), Power (9 pins), ISOSPI (10 pins), GPIO_Ex (C38.1 U15.2 U15.8)
3V3 (ISO): Microcontroller (6 pins), Power (C14.2 C15.2 U5.5)
5V (ISO): CAN (C19.2 C26.2 U6.1 U9.1), Green Loop (5 pins), PDOC (6 pins), Precharge (D17.A D18.K U20.2), Power (8 pins), ISOSPI (5 pins), GPIO_Ex (C38.2 U15.1 U15.7)
DISCHARGE DISABLE: Top Level (P1.12 P5.5 P5.7 P14.2), CAN (C18.2 C25.2 U6.8 U9.8), Green Loop (5 pins), Precharge (Q6.D R30.2), Power (C17.2 D4.A L2.1 U4.3), GPIO_Ex (8 pins)
GLV+: Top Level (P1.6 P3.1), Power (F1.1)
GLV-: Top Level (P1.5), Precharge (5 pins), Power (5 pins)
AIR+: Top Level (P5.4), Precharge (D12.A D15.K Q5.D)
AIR-: Top Level (P5.2), Precharge (D11.A D14.K Q4.D)
AIR_PWR_HEADER: Top Level (P1.11 P5.1 P5.3), Precharge (5 pins), GPIO_Ex (R44.2)
CAN1_N: Top Level (P1.2), CAN (C22.2 R5.1 U7.2)
CAN1_P: Top Level (P1.1), CAN (C21.2 R4.2 U7.1)
CAN1_RX: Microcontroller (U1.23), CAN (U6.3)
CAN1_TX: Microcontroller (U1.21), CAN (U6.2)
CAN2_N: Top Level (P2.2), CAN (C29.2 R7.1 U10.2)
CAN2_P: Top Level (P2.4), CAN (C28.2 R6.2 U10.1)
CAN2_RX: Microcontroller (U1.10), CAN (U9.3)
CAN2_TX: Microcontroller (U1.11), CAN (U9.2)
Charge_En: Top Level (P2.1), Charge Interface (D22.A)
Charge_Ready: Top Level (P2.3), Charge Interface (D21.A)
dIP_AIR+_FB: Top Level (P5.8), GPIO_Ex (U19.4)
dIP_AIR-_FB: Top Level (P5.6), GPIO_Ex (U19.3)
dIP_IMD_DATA: Microcontroller (U1.26), Green Loop (U14.6)
dIP_IMD_OK: Microcontroller (U1.27), Green Loop (U14.7)
dIP_SPI_MISO: Microcontroller (U1.12), ISOSPI (D16.K), GPIO_Ex (D20.K)
dOP_AIR+: Precharge (R32.1 R35.1), GPIO_Ex (U19.6)
dOP_AIR-: Precharge (R31.1 R34.1), GPIO_Ex (U19.2)
dOP_CHARGE_EN: Charge Interface (R52.1), GPIO_Ex (U19.16)
dOP_CHARGE_RDY: Charge Interface (R50.1), GPIO_Ex (U19.15)
dOP_DISCHARGE DISABLE: Precharge (R33.1 R36.1), GPIO_Ex (U19.1)
dOP_PRECHARGE_RLY: Microcontroller (U1.20), Precharge (R42.1)
dOP_SPI_MOSI: Microcontroller (U1.13), ISOSPI (U12.2), GPIO_Ex (U15.5)
dOP_SPI_nSS: Microcontroller (U1.17), GPIO_Ex (U15.3)
dOP_SPI_SCK: Microcontroller (U1.14), ISOSPI (U12.4), GPIO_Ex (U15.4)
GL_IN: Top Level (P1.8), Green Loop (IMD.2 K1.13)
GL_OUT: Top Level (P1.7), PDOC (K2.9 PDOC.1)
GL_PDOC_IN: Green Loop (AMS.1 K3.9), PDOC (K2.13 PDOC.2)
HV Battery+: Top Level (P7.1 P7.2 P8.1 P8.2), Precharge (R41.2)
HV MC+: Top Level (P6.1 P6.2 P9.1 P9.2), Precharge (R37.1)
I2C1_SCL: Microcontroller (U1.18), PDOC (U18.2)
I2C1_SDA: Microcontroller (U1.19), PDOC (U18.3)
IMD Data: Top Level (P3.4), Green Loop (U14.3)
IMD OK: Top Level (P3.2), Green Loop (R13.1 U14.2)
ISO_SPI_N: Top Level (P4.2), ISOSPI (U13.1)
ISO_SPI_P: Top Level (P4.1), ISOSPI (U13.3)